# EAGLE design Schematic SF FM v1.26 (EAGLE 9.6.2)

## Sheet 1 of 3: MULTI-SPEC CAMERA MISSION
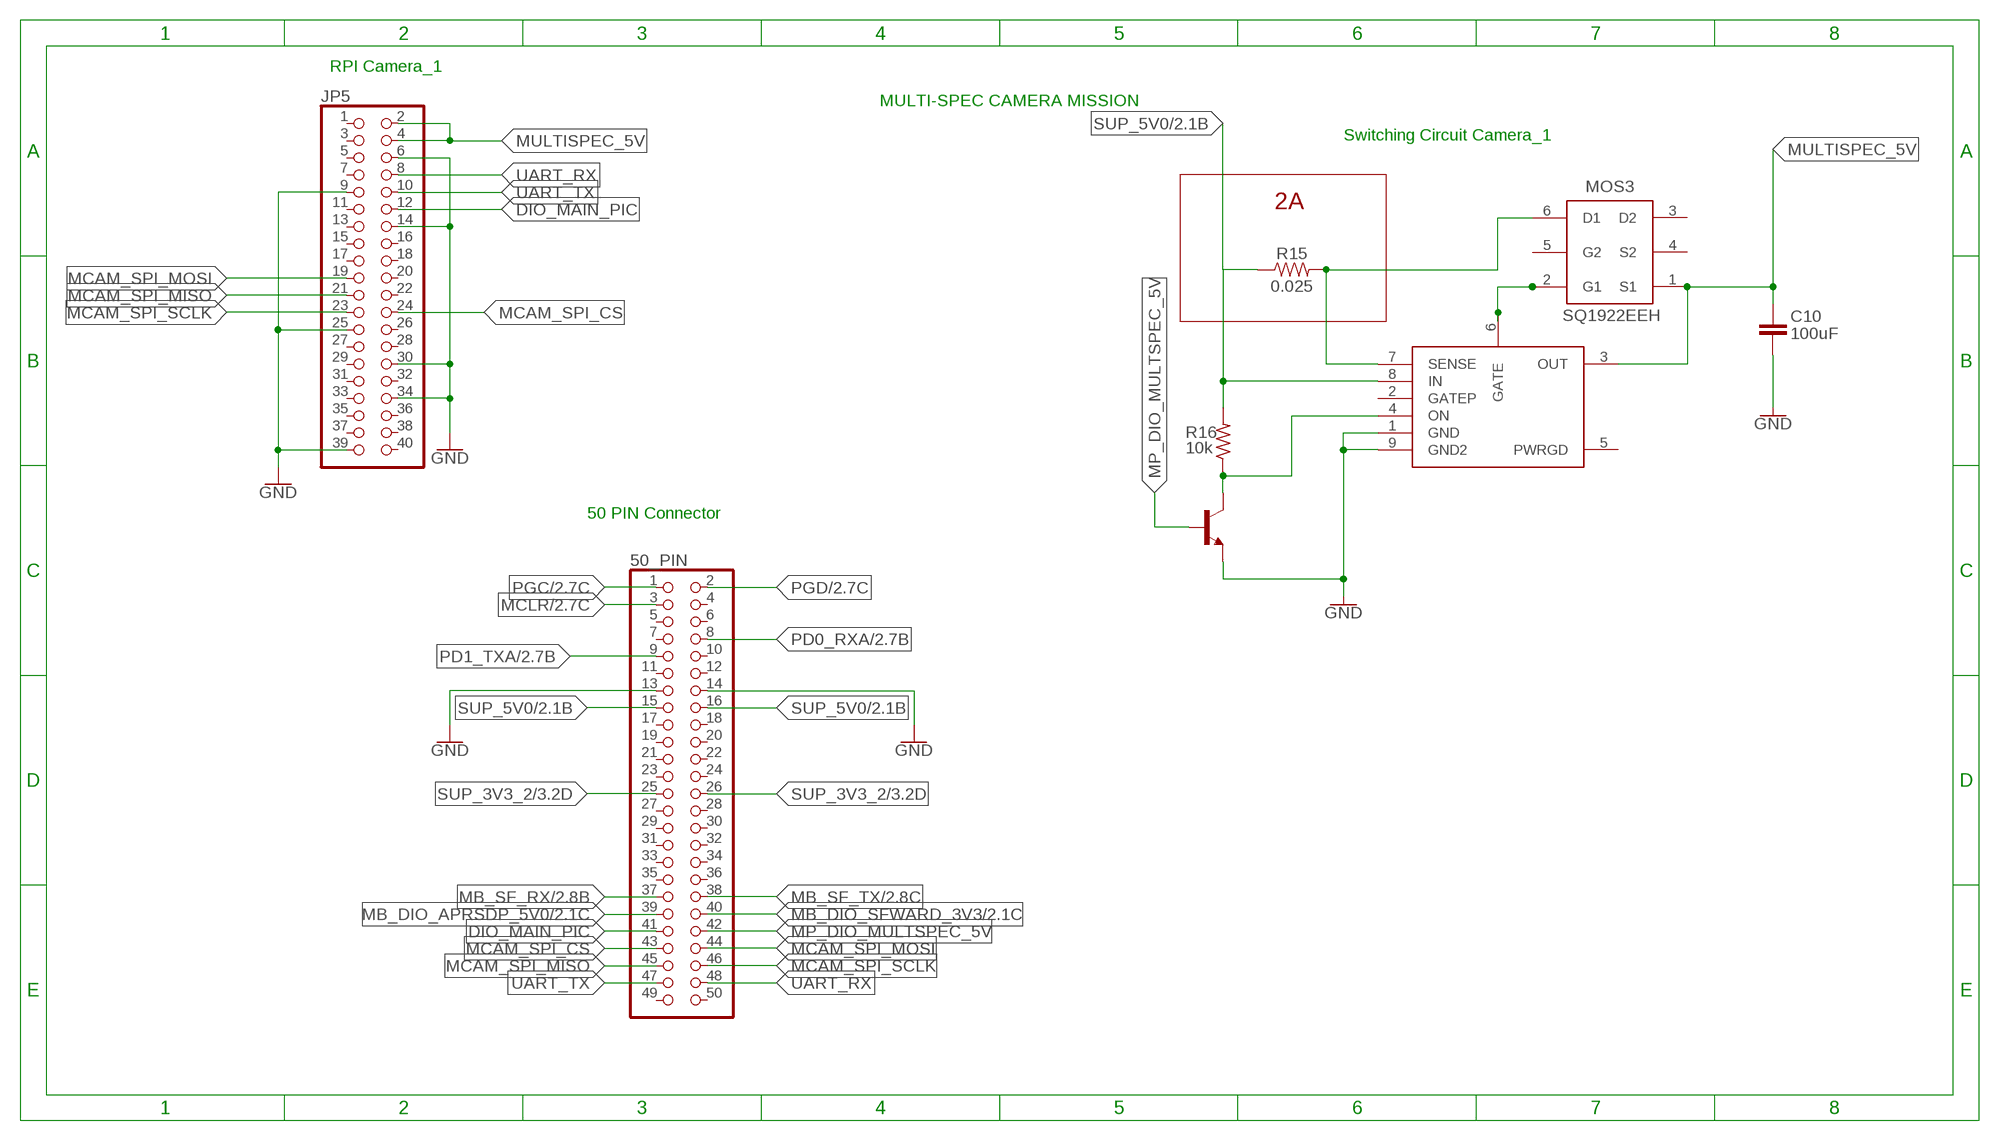
[diagram p0: schematic, sheet 1]

### Parts
50_PIN  PINHD-2X25_2.00  [2X25M]
C10  100uF  C0805(2012)  [C0805]
JP5  PINHD-2X20  [2X20]
MOS3  SQ1922EEH  [SOT65P210X110-6N]
Q4  DTC144EKA  [SOT346-R]
R15  0.025  R0805(2012)  [R0805]
R16  10k  R-US_R0603  [R0603]
U$2  BIRDS5_LTC4361  [BIRDS5_LTC4361]

### Nets
DIO_MAIN_PIC: 50_PIN.41 JP5.12
GATE1: MOS3.2(G1) U$2.6(GATE)
GND: 50_PIN.13 50_PIN.14 C10.2 JP5.6 JP5.9 JP5.14 JP5.25 JP5.30 JP5.34 JP5.39 Q4.1(E) U$2.1(GND) U$2.9(GND2) ; also sheet 2,3
MB_DIO_APRSDP_5V0: 50_PIN.39 ; also sheet 2
MB_DIO_SFWARD_3V3: 50_PIN.40 ; also sheet 2,3
MB_SF_RX: 50_PIN.37 ; also sheet 2,3
MB_SF_TX: 50_PIN.38 ; also sheet 2,3
MCAM_SPI_CS: 50_PIN.43 JP5.24
MCAM_SPI_MISO: 50_PIN.45 JP5.21
MCAM_SPI_MOSI: 50_PIN.44 JP5.19
MCAM_SPI_SCLK: 50_PIN.46 JP5.23
MCLR: 50_PIN.3 ; also sheet 2,3
MP_DIO_MULTSPEC_5V: 50_PIN.42 Q4.2(B)
MULTISPEC_5V: C10.1 JP5.2 JP5.4 MOS3.1(S1) U$2.3(OUT)
ON1: Q4.3(C) R16.1 U$2.4(ON)
PD0_RXA: 50_PIN.8 ; also sheet 2
PD1_TXA: 50_PIN.9 ; also sheet 2
PGC: 50_PIN.1 ; also sheet 2,3
PGD: 50_PIN.2 ; also sheet 2,3
SENSE1: MOS3.6(D1) R15.2 U$2.7(SENSE)
SUP_3V3_2: 50_PIN.25 50_PIN.26 ; also sheet 3
SUP_5V0: 50_PIN.15 50_PIN.16 R15.1 R16.2 U$2.8(IN) ; also sheet 2
UART_RX: 50_PIN.48 JP5.8
UART_TX: 50_PIN.47 JP5.10
Unconnected: 50_PIN.4 50_PIN.5 50_PIN.6 50_PIN.7 50_PIN.10 50_PIN.11 50_PIN.12 50_PIN.17 50_PIN.18 50_PIN.19 50_PIN.20 50_PIN.21 50_PIN.22 50_PIN.23 50_PIN.24 50_PIN.27 50_PIN.28 50_PIN.29 50_PIN.30 50_PIN.31 50_PIN.32 50_PIN.33 50_PIN.34 50_PIN.35 50_PIN.36 50_PIN.49 50_PIN.50 JP5.1 JP5.3 JP5.5 JP5.7 JP5.11 JP5.13 JP5.15 JP5.16 JP5.17 JP5.18 JP5.20 JP5.22 JP5.26 JP5.27 JP5.28 JP5.29 JP5.31 JP5.32 JP5.33 JP5.35 JP5.36 JP5.37 JP5.38 JP5.40 MOS3.3(D2) MOS3.4(S2) MOS3.5(G2) U$2.2(GATEP) U$2.5(PWRGD)

### Notes on the sheet
- RPI Camera_1
- MULTI-SPEC CAMERA MISSION
- Switching Circuit Camera_1
- 2A
- 50 PIN Connector

## Sheet 2 of 3: APRS/DP MISSION
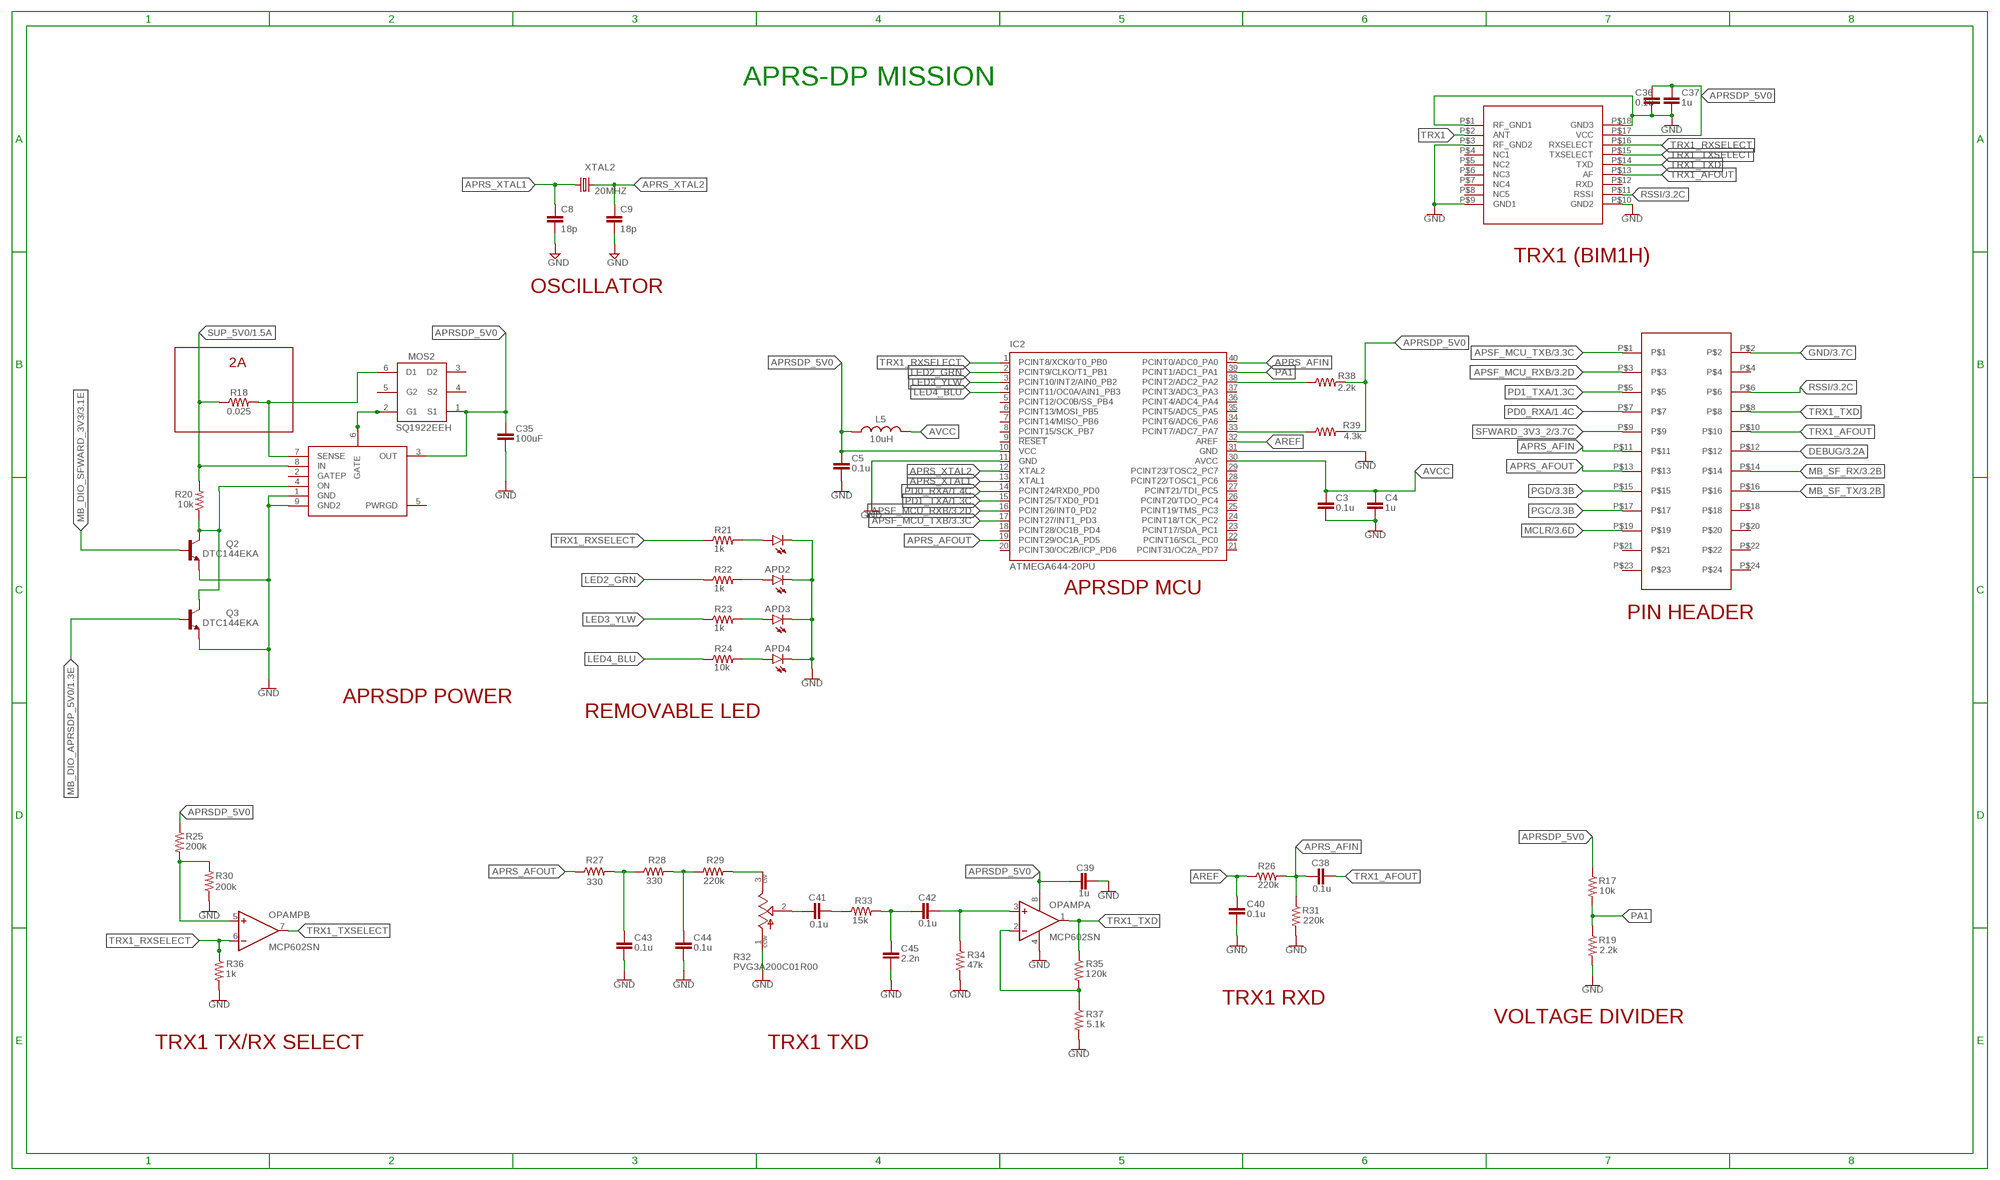
[diagram p1: schematic, sheet 2]

### Parts
APD1  LEDSML0603  [SML0603]
APD2  LEDSML0603  [SML0603]
APD3  LEDSML0603  [SML0603]
APD4  LEDSML0603  [SML0603]
C3  0.1u  CC0603  [C0603]
C4  1u  CC0603  [C0603]
C5  0.1u  CC0603  [C0603]
C8  18p  C  [C0805]
C9  18p  C  [C0805]
C35  100uF  C0805(2012)  [C0805]
C36  0.1u  CC0603  [C0603]
C37  1u  CC0603  [C0603]
C38  0.1u  CC0603  [C0603]
C39  1u  CC0603  [C0603]
C40  0.1u  CC0603  [C0603]
C41  0.1u  CC0603  [C0603]
C42  0.1u  CC0603  [C0603]
C43  0.1u  CC0603  [C0603]
C44  0.1u  CC0603  [C0603]
C45  2.2n  CC0603  [C0603]
IC2  ATMEGA644-20PU  [DIL40]
JP1  RAB_ACCESS  [RAB_ACCESS]
L5  10uH  L-USL2012C  [L2012C]
MOS2  SQ1922EEH  [SOT65P210X110-6N]
OPAMP  MCP602SN  [SO08]
Q2  DTC144EKA  [SOT346-R]
Q3  DTC144EKA  [SOT346-R]
R17  10k  R-US_R0603  [R0603]
R18  0.025  R-US_R0805  [R0805]
R19  2.2k  R-US_R0603  [R0603]
R20  10k  R-US_R0603  [R0603]
R21  1k  R-US_R0603  [R0603]
R22  1k  R-US_R0603  [R0603]
R23  1k  R-US_R0603  [R0603]
R24  10k  R-US_R0603  [R0603]
R25  200k  R-US_R0603  [R0603]
R26  220k  R-US_R0603  [R0603]
R27  330  R-US_R0603  [R0603]
R28  330  R-US_R0603  [R0603]
R29  220k  R-US_R0603  [R0603]
R30  200k  R-US_R0603  [R0603]
R31  220k  R-US_R0603  [R0603]
R32  PVG3A200C01R00  [TRIM_PVG3A200C01R00]
R33  15k  R-US_R0603  [R0603]
R34  47k  R-US_R0603  [R0603]
R35  120k  R-US_R0603  [R0603]
R36  1k  R-US_R0603  [R0603]
R37  5.1k  R-US_R0603  [R0603]
R38  2.2k  R-US_R0603  [R0603]
R39  4.3k  R-US_R0603  [R0603]
TRX1  BIM1H  [BIM1H]
U$1  BIRDS5_LTC4361  [BIRDS5_LTC4361]
XTAL2  20MHZ  CRYSTALSM49  [SM49]

### Nets
APRS_AFIN: C38.1 IC2.40(PCINT0/ADC0_PA0) JP1.P$11 R26.2 R31.1
APRS_AFOUT: IC2.19(PCINT29/OC1A_PD5) JP1.P$13 R27.1
APRS_XTAL1: C8.1 IC2.13(XTAL1) XTAL2.1
APRS_XTAL2: C9.1 IC2.12(XTAL2) XTAL2.2
APRSDP_5V0: C5.2 C35.1 C36.1 C37.1 C39.1 IC2.10(VCC) L5.1 MOS2.1(S1) OPAMP.8(P:V+) R17.1 R25.1 R38.2 R39.2 TRX1.P$17(VCC) U$1.3(OUT)
APSF_MCU_RXB: IC2.16(PCINT26/INT0_PD2) JP1.P$3 ; also sheet 3
APSF_MCU_TXB: IC2.17(PCINT27/INT1_PD3) JP1.P$1 ; also sheet 3
AREF: C40.1 IC2.32(AREF) R26.1
AVCC: C3.1 C4.1 IC2.30(AVCC) L5.2
DEBUG: JP1.P$12 ; also sheet 3
GATE4: MOS2.2(G1) U$1.6(GATE)
GND: APD1.C APD2.C APD3.C APD4.C C3.2 C4.2 C5.1 C8.2 C9.2 C35.2 C36.2 C37.2 C39.2 C40.2 C43.2 C44.2 C45.2 IC2.11(GND) IC2.31(GND) JP1.P$2 OPAMP.4(P:V-) Q2.1(E) Q3.1(E) R19.2 R30.1 R31.2 R32.1(CCW) R34.2 R36.2 R37.2 TRX1.P$1(RF_GND1) TRX1.P$3(RF_GND2) TRX1.P$9(GND1) TRX1.P$10(GND2) TRX1.P$18(GND3) U$1.1(GND) U$1.9(GND2) ; also sheet 1,3
LED2_GRN: IC2.2(PCINT9/CLKO/T1_PB1) R22.1
LED3_YLW: IC2.3(PCINT10/INT2/AIN0_PB2) R23.1
LED4_BLU: IC2.4(PCINT11/OC0A/AIN1_PB3) R24.1
MB_DIO_APRSDP_5V0: Q3.2(B) ; also sheet 1
MB_DIO_SFWARD_3V3: Q2.2(B) ; also sheet 1,3
MB_SF_RX: JP1.P$14 ; also sheet 1,3
MB_SF_TX: JP1.P$16 ; also sheet 1,3
MCLR: JP1.P$19 ; also sheet 1,3
N$10: R29.2 R32.3(CW)
N$12: APD1.A R21.2
N$13: APD2.A R22.2
N$14: APD3.A R23.2
N$15: APD4.A R24.2
N$16: C43.1 R27.2 R28.1
N$17: C44.1 R28.2 R29.1
N$18: C42.1 C45.1 R33.2
N$19: C41.2 R33.1
N$20: OPAMP.2(A:-IN) R35.2 R37.1
N$21: OPAMP.5(B:+IN) R25.2 R30.2
N$22: C41.1 R32.2(WIPER)
N$34: IC2.38(PCINT2/ADC2_PA2) R38.1
N$38: IC2.33(PCINT7/ADC7_PA7) R39.1
ON4: Q2.3(C) Q3.3(C) R20.1 U$1.4(ON)
OPAMP_A+: C42.2 OPAMP.3(A:+IN) R34.1
PA1: IC2.39(PCINT1/ADC1_PA1) R17.2 R19.1
PD0_RXA: IC2.14(PCINT24/RXD0_PD0) JP1.P$7 ; also sheet 1
PD1_TXA: IC2.15(PCINT25/TXD0_PD1) JP1.P$5 ; also sheet 1
PGC: JP1.P$17 ; also sheet 1,3
PGD: JP1.P$15 ; also sheet 1,3
RSSI: JP1.P$6 TRX1.P$11(RSSI) ; also sheet 3
SENSE4: MOS2.6(D1) R18.2 U$1.7(SENSE)
SFWARD_3V3_2: JP1.P$9 ; also sheet 3
SUP_5V0: R18.1 R20.2 U$1.8(IN) ; also sheet 1
TRX1: TRX1.P$2(ANT) ; also sheet 3
TRX1_AFOUT: C38.2 JP1.P$10 TRX1.P$13(AF)
TRX1_RXSELECT: IC2.1(PCINT8/XCK0/T0_PB0) OPAMP.6(B:-IN) R21.1 R36.1 TRX1.P$16(RXSELECT)
TRX1_TXD: JP1.P$8 OPAMP.1(A:OUT) R35.1 TRX1.P$14(TXD)
TRX1_TXSELECT: OPAMP.7(B:OUT) TRX1.P$15(TXSELECT)
Unconnected: IC2.5(PCINT12/OC0B/SS_PB4) IC2.6(PCINT13/MOSI_PB5) IC2.7(PCINT14/MISO_PB6) IC2.8(PCINT15/SCK_PB7) IC2.9(!RESET) IC2.18(PCINT28/OC1B_PD4) IC2.20(PCINT30/OC2B/ICP_PD6) IC2.21(PCINT31/OC2A_PD7) IC2.22(PCINT16/SCL_PC0) IC2.23(PCINT17/SDA_PC1) IC2.24(PCINT18/TCK_PC2) IC2.25(PCINT19/TMS_PC3) IC2.26(PCINT20/TDO_PC4) IC2.27(PCINT21/TDI_PC5) IC2.28(PCINT22/TOSC1_PC6) IC2.29(PCINT23/TOSC2_PC7) IC2.34(PCINT6/ADC6_PA6) IC2.35(PCINT5/ADC5_PA5) IC2.36(PCINT4/ADC4_PA4) IC2.37(PCINT3/ADC3_PA3) JP1.P$4 JP1.P$18 JP1.P$20 JP1.P$21 JP1.P$22 JP1.P$23 JP1.P$24 MOS2.3(D2) MOS2.4(S2) MOS2.5(G2) TRX1.P$4(NC1) TRX1.P$5(NC2) TRX1.P$6(NC3) TRX1.P$7(NC4) TRX1.P$8(NC5) TRX1.P$12(RXD) U$1.2(GATEP) U$1.5(PWRGD)

### Notes on the sheet
- APRS-DP MISSION
- TRX1 (BIM1H)
- OSCILLATOR
- 2A
- APRSDP MCU
- PIN HEADER
- APRSDP POWER
- REMOVABLE LED
- TRX1 RXD
- VOLTAGE DIVIDER
- TRX1 TX/RX SELECT | TRX1 TXD

## Sheet 3 of 3: SF-WARD MISSION
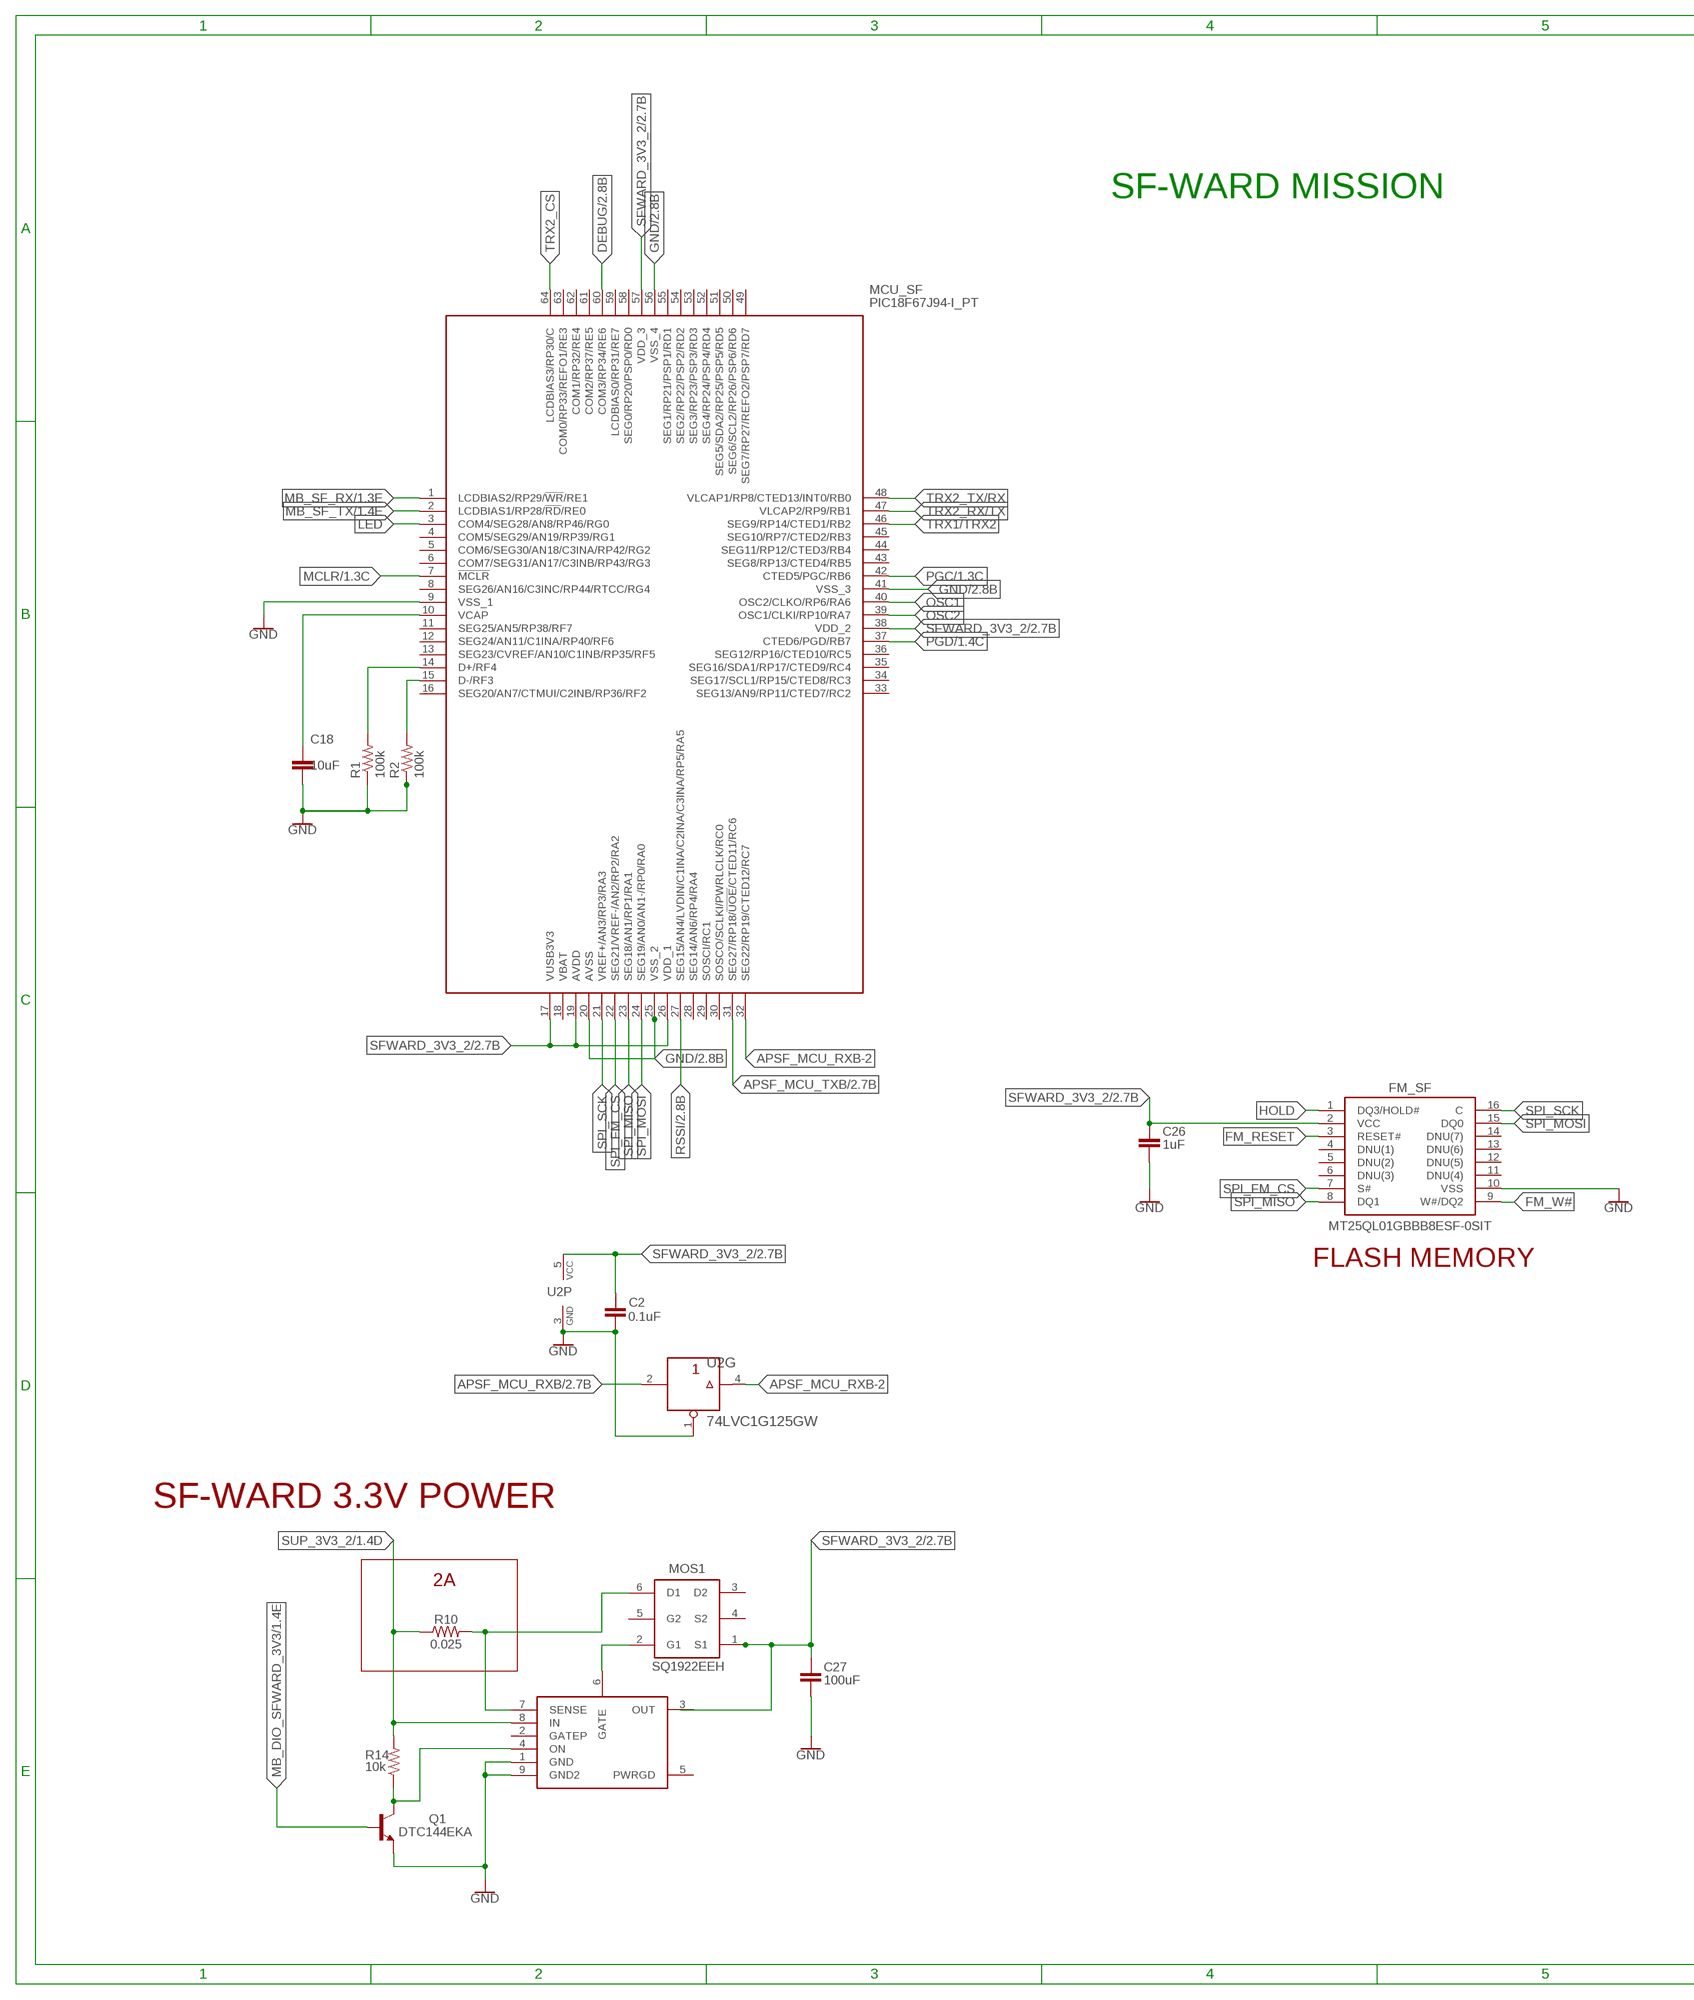
[diagram p2: schematic, sheet 3, part 1 of 2]
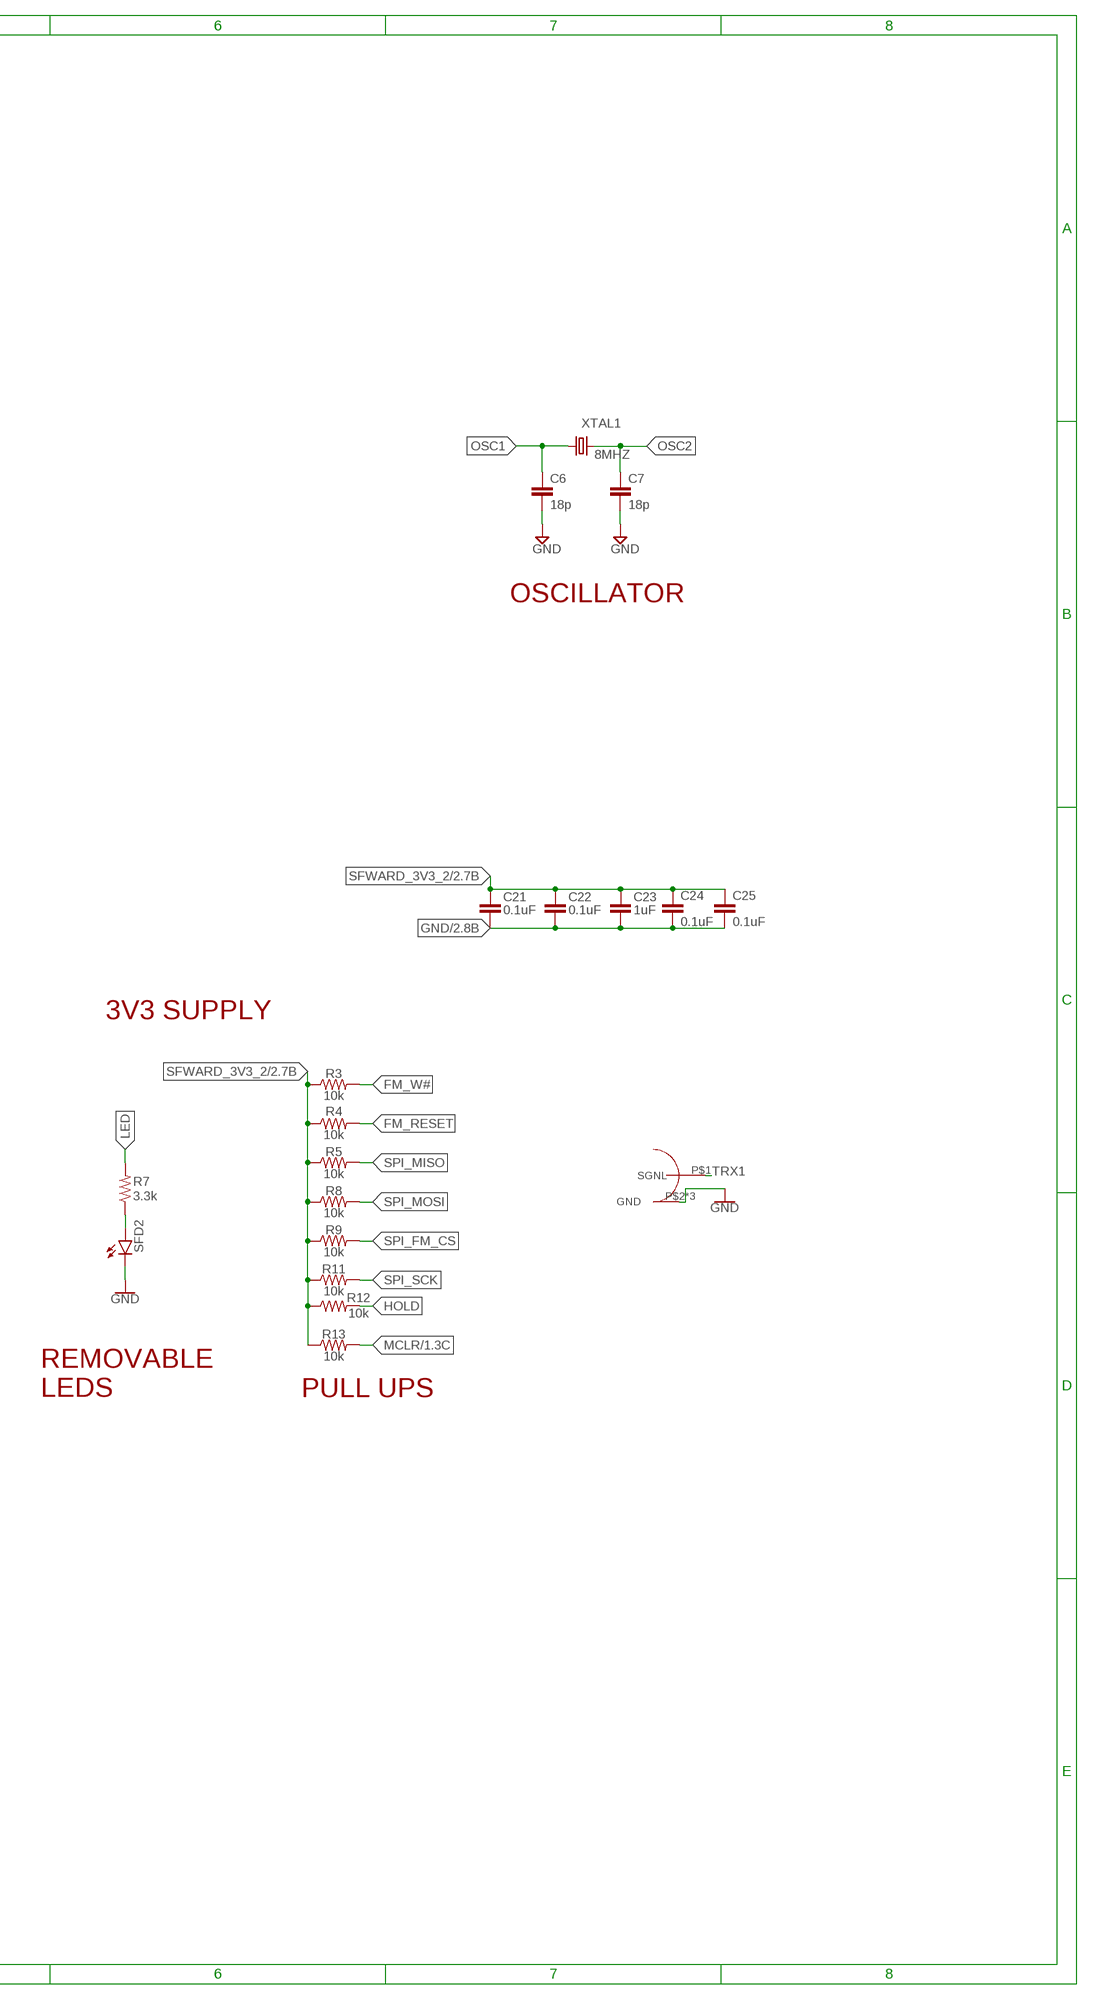
[diagram p3: schematic, sheet 3, part 2 of 2]

### Parts
C2  0.1uF  CC0603  [C0603]
C6  18p  C  [C0805]
C7  18p  C  [C0805]
C18  10uF  C-EUC0603  [C0603]
C21  0.1uF  C-EUC0603  [C0603]
C22  0.1uF  C-EUC0603  [C0603]
C23  1uF  C-EUC0603  [C0603]
C24  0.1uF  C-EUC0603  [C0603]
C25  0.1uF  C-EUC0603  [C0603]
C26  1uF  C-EUC0603  [C0603]
C27  100uF  C0805(2012)  [C0805]
FM_SF  MT25QL01GBBB8ESF-0SIT  [SOIC127P1032X265-16N]
MCU_SF  PIC18F67J94-I_PT  [QFP50P1200X1200X120-64N]
MMCX_908_222101T  MMCX_908_222101T  [MMCX_908_222101T]
MOS1  SQ1922EEH  [SOT65P210X110-6N]
Q1  DTC144EKA  [SOT346-R]
R1  100k  R-US_R0603  [R0603]
R2  100k  R-US_R0603  [R0603]
R3  10k  R-US_R0603  [R0603]
R4  10k  R-US_R0603  [R0603]
R5  10k  R-US_R0603  [R0603]
R7  3.3k  R-US_R0603  [R0603]
R8  10k  R-US_R0603  [R0603]
R9  10k  R-US_R0603  [R0603]
R10  0.025  R0805(2012)  [R0805]
R11  10k  R-US_R0603  [R0603]
R12  10k  R-US_R0603  [R0603]
R13  10k  R-US_R0603  [R0603]
R14  10k  R-US_R0603  [R0603]
SFD2  LEDCHIPLED_0603  [CHIPLED_0603]
U2  74LVC1G125GW  [SOT353-1]
U$3  BIRDS5_LTC4361  [BIRDS5_LTC4361]
XTAL1  8MHZ  CRYSTALSM49  [SM49]

### Nets
APSF_MCU_RXB: U2.2(G:A) ; also sheet 2
APSF_MCU_RXB-2: MCU_SF.32(SEG22/RP19/CTED12/RC7) U2.4(G:Y)
APSF_MCU_TXB: MCU_SF.31(SEG27/RP18/!UOE!/CTED11/RC6) ; also sheet 2
DEBUG: MCU_SF.60(COM3/RP34/RE6) ; also sheet 2
FM_RESET: FM_SF.3(RESET#) R4.2
FM_W#: FM_SF.9(W#/DQ2) R3.2
GATE3: MOS1.2(G1) U$3.6(GATE)
GND: C2.1 C6.2 C7.2 C18.2 C21.2 C22.2 C23.2 C24.2 C25.2 C26.2 C27.2 FM_SF.10(VSS) MCU_SF.9(VSS_1) MCU_SF.20(AVSS) MCU_SF.25(VSS_2) MCU_SF.41(VSS_3) MCU_SF.56(VSS_4) MMCX_908_222101T.P$2(GND) MMCX_908_222101T.P$3(GND) MMCX_908_222101T.P$4(GND) Q1.1(E) R1.1 R2.1 SFD2.C U2.1(G:OEN) U2.3(P:GND) U$3.1(GND) U$3.9(GND2) ; also sheet 1,2
HOLD: FM_SF.1(DQ3/HOLD#) R12.2
LED: MCU_SF.3(COM4/SEG28/AN8/RP46/RG0) R7.2
MB_DIO_SFWARD_3V3: Q1.2(B) ; also sheet 1,2
MB_SF_RX: MCU_SF.1(LCDBIAS2/RP29/!WR!/RE1) ; also sheet 1,2
MB_SF_TX: MCU_SF.2(LCDBIAS1/RP28/!RD!/RE0) ; also sheet 1,2
MCLR: MCU_SF.7(!MCLR) R13.2 ; also sheet 1,2
N$2: C18.1 MCU_SF.10(VCAP)
N$7: MCU_SF.14(D+/RF4) R1.2
N$8: MCU_SF.15(D-/RF3) R2.2
N$11: R7.1 SFD2.A
ON3: Q1.3(C) R14.1 U$3.4(ON)
OSC1: C6.1 MCU_SF.40(OSC2/CLKO/RP6/RA6) XTAL1.1
OSC2: C7.1 MCU_SF.39(OSC1/CLKI/RP10/RA7) XTAL1.2
PGC: MCU_SF.42(CTED5/PGC/RB6) ; also sheet 1,2
PGD: MCU_SF.37(CTED6/PGD/RB7) ; also sheet 1,2
RSSI: MCU_SF.27(SEG15/AN4/LVDIN/C1INA/C2INA/C3INA/RP5/RA5) ; also sheet 2
SENSE3: MOS1.6(D1) R10.2 U$3.7(SENSE)
SFWARD_3V3_2: C2.2 C21.1 C22.1 C23.1 C24.1 C25.1 C26.1 C27.1 FM_SF.2(VCC) MCU_SF.17(VUSB3V3) MCU_SF.19(AVDD) MCU_SF.26(VDD_1) MCU_SF.38(VDD_2) MCU_SF.57(VDD_3) MOS1.1(S1) R3.1 R4.1 R5.1 R8.1 R9.1 R11.1 R12.1 R13.1 U2.5(P:VCC) U$3.3(OUT) ; also sheet 2
SPI_FM_CS: FM_SF.7(S#) MCU_SF.22(SEG21/VREF-/AN2/RP2/RA2) R9.2
SPI_MISO: FM_SF.8(DQ1) MCU_SF.23(SEG18/AN1/RP1/RA1) R5.2
SPI_MOSI: FM_SF.15(DQ0) MCU_SF.24(SEG19/AN0/AN1-/RP0/RA0) R8.2
SPI_SCK: FM_SF.16(C) MCU_SF.21(VREF+/AN3/RP3/RA3) R11.2
SUP_3V3_2: R10.1 R14.2 U$3.8(IN) ; also sheet 1
TRX1: MMCX_908_222101T.P$1(SGNL) ; also sheet 2
TRX1/TRX2: MCU_SF.46(SEG9/RP14/CTED1/RB2)
TRX2_CS: MCU_SF.64(LCDBIAS3/RP30/C)
TRX2_RX/TX: MCU_SF.47(VLCAP2/RP9/RB1)
TRX2_TX/RX: MCU_SF.48(VLCAP1/RP8/CTED13/INT0/RB0)
Unconnected: FM_SF.4(DNU(1)) FM_SF.5(DNU(2)) FM_SF.6(DNU(3)) FM_SF.11(DNU(4)) FM_SF.12(DNU(5)) FM_SF.13(DNU(6)) FM_SF.14(DNU(7)) MCU_SF.4(COM5/SEG29/AN19/RP39/RG1) MCU_SF.5(COM6/SEG30/AN18/C3INA/RP42/RG2) MCU_SF.6(COM7/SEG31/AN17/C3INB/RP43/RG3) MCU_SF.8(SEG26/AN16/C3INC/RP44/RTCC/RG4) MCU_SF.11(SEG25/AN5/RP38/RF7) MCU_SF.12(SEG24/AN11/C1INA/RP40/RF6) MCU_SF.13(SEG23/CVREF/AN10/C1INB/RP35/RF5) MCU_SF.16(SEG20/AN7/CTMUI/C2INB/RP36/RF2) MCU_SF.18(VBAT) MCU_SF.28(SEG14/AN6/RP4/RA4) MCU_SF.29(SOSCI/RC1) MCU_SF.30(SOSCO/SCLKI/PWRLCLK/RC0) MCU_SF.33(SEG13/AN9/RP11/CTED7/RC2) MCU_SF.34(SEG17/SCL1/RP15/CTED8/RC3) MCU_SF.35(SEG16/SDA1/RP17/CTED9/RC4) MCU_SF.36(SEG12/RP16/CTED10/RC5) MCU_SF.43(SEG8/RP13/CTED4/RB5) MCU_SF.44(SEG11/RP12/CTED3/RB4) MCU_SF.45(SEG10/RP7/CTED2/RB3) MCU_SF.49(SEG7/RP27/REFO2/PSP7/RD7) MCU_SF.50(SEG6/SCL2/RP26/PSP6/RD6) MCU_SF.51(SEG5/SDA2/RP25/PSP5/RD5) MCU_SF.52(SEG4/RP24/PSP4/RD4) MCU_SF.53(SEG3/RP23/PSP3/RD3) MCU_SF.54(SEG2/RP22/PSP2/RD2) MCU_SF.55(SEG1/RP21/PSP1/RD1) MCU_SF.58(SEG0/RP20/PSP0/RD0) MCU_SF.59(LCDBIAS0/RP31/RE7) MCU_SF.61(COM2/RP37/RE5) MCU_SF.62(COM1/RP32/RE4) MCU_SF.63(COM0/RP33/REFO1/RE3) MOS1.3(D2) MOS1.4(S2) MOS1.5(G2) U$3.2(GATEP) U$3.5(PWRGD)

### Notes on the sheet
- SF-WARD MISSION
- OSCILLATOR
- 3V3 SUPPLY
- FLASH MEMORY
- REMOVABLE
  LEDS
- PULL UPS
- SF-WARD 3.3V POWER
- 2A

## Library data of the parts
50_PIN = pinhead-1:PINHD-2X25: PIN HEADER
APD1-APD4 SFD2 = led:LED: LED OSRAM: - CHIPLED LG R971, LG N971, LY N971, LG Q971, LY Q971, LO R971, LY R971 LH N974, LH R974 LS Q976, LO Q976, LY Q976 LO Q996 - Hyper CHIPLED LW Q18S LB Q993, LB Q99A, LB R99A - SideLED LS A670, LO A670, LY A670, LG A670, LP A670 LB A673, LV A673, LT A673, LW A673 LH A674 LY A675 LS A676, LA A676, LO A676, LY A676, LW A676 LS A679, LY A679, LG A679 - Hyper Micro SIDELED® LS Y876, LA Y876, LO Y876, LY Y876 LT Y87S - SmartLED LW L88C, LW L88S LB L89C, LB L89S, LG L890 LS L89K, LO L89K, LY L89K LS L896, LA L896, LO L896, LY L896 - TOPLED LS T670, LO T670, LY T670, LG T670, LP T670 LSG T670, LSP T670, LSY T670, LOP T670, LYG T670 LG T671, LOG T671, LSG T671 LB T673, LV T673, LT T673, LW T673 LH T674 LS T676, LA T676, LO T676, LY T676, LB T676, LH T676, LSB T676, LW T676 LB T67C, LV T67C, LT T67C, LS T67K, LO T67K, LY T67K, LW E67C LS E67B, LA E67B, LO E67B, LY E67B, LB E67C, LV E67C, LT E67C LW T67C LS T679, LY T679, LG T679 LS T770, LO T770, LY T770, LG T770, LP T770 LB T773, LV T773, LT T773, LW T773 LH T774 LS E675, LA E675, LY E675, LS T675 LS T776, LA T776, LO T776, LY T776, LB T776 LHGB T686 LT T68C, LB T68C - Hyper Mini TOPLED® LB M676 - Mini TOPLED Santana® LG M470 LS M47K, LO M47K, LY M47K Source: http://www.osram.convergy.de LUXEON: - LUMILED® LXK2-PW12-R00, LXK2-PW12-S00, LXK2-PW14-U00, LXK2-PW14-V00 LXK2-PM12-R00, LXK2-PM12-S00, LXK2-PM14-U00 LXK2-PE12-Q00, LXK2-PE12-R00, LXK2-PE12-S00, LXK2-PE14-T00, LXK2-PE14-U00 LXK2-PB12-K00, LXK2-PB12-L00, LXK2-PB12-M00, LXK2-PB14-N00, LXK2-PB14-P00, LXK2-PB14-Q00 LXK2-PR12-L00, LXK2-PR12-M00, LXK2-PR14-Q00, LXK2-PR14-R00 LXK2-PD12-Q00, LXK2-PD12-R00, LXK2-PD12-S00 LXK2-PH12-R00, LXK2-PH12-S00 LXK2-PL12-P00, LXK2-PL12-Q00, LXK2-PL12-R00 Source: www.luxeon.com KINGBRIGHT: KA-3528ASYC Source: www.kingbright.com
C2-C9 C36-C45 = eagle-ltspice:C: CAPACITOR, European symbol; SPICEMODEL: NONE; SPICEPREFIX: C
C10 C27 C35 = BIRDS3_CAM_MSN:C0805(2012)
C18 C21-C26 = rcl:C-EU: CAPACITOR, European symbol; SPICEPREFIX: C
FM_SF = BIRDS3_CAM_MSN:MT25QL01GBBB8ESF-0SIT: IC FLASH 1GBIT 108MHZ 16SOIC Source: Datasheet <https://www.micron.com/~/media/documents/products/data-sheet/nor-flash/serial-nor/mt25q/die-rev-b/mt25q_qlkt_l_01g_bbb_0.pdf>; DESCRIPTION: IC FLASH 1GBIT 108MHZ 16SOIC; HEIGHT: 2.65mm; MANUFACTURER_NAME: Micron; MANUFACTURER_PART_NUMBER: MT25QL01GBBB8ESF-0SIT; SUPPLIER_NAME: RS
IC2 = atmel:ATMEGA644-*PU: 8-bit Microcontroller with 64K Bytes In-System Programmable Flash Auto generated by make-symbol-device-package-bsdl.ulp Rev. 34 Source: http://www.atmel.com/dyn/resources/prod_documents/doc2593.pdf; MPN: ATMEGA644-20PU; OC_FARNELL: 1288340; OC_NEWARK: 23M5060
JP1 = BIRDS_4_general_components_library:RAB_ACCESS
JP5 = pinhead:PINHD-2X20: PIN HEADER
L5 = rcl:L-US: INDUCTOR, American symbol; SPICEPREFIX: L
MCU_SF = PIC18F67J94-I_PT:PIC18F67J94-I_PT: MCU 8-Bit 128K Flash LCD USB XLP TQFP64 Microchip PIC18F67J94-I/PT, 8bit PIC Microcontroller, 64MHz, 128 kB Flash, 64-Pin TQFP Source: Datasheet <http://uk.rs-online.com/web/p/products/8233908>; ALLIED_NUMBER: 70470236; ALLIED_PRICE-STOCK: https://www.alliedelec.com/microchip-technology-inc-pic18f67j94-i-pt/70470236/; DESCRIPTION: MCU 8-Bit 128K Flash LCD USB XLP TQFP64 Microchip PIC18F67J94-I/PT, 8bit PIC Microcontroller, 64MHz, 128 kB Flash, 64-Pin TQFP; HEIGHT: 1.2mm; MANUFACTURER_NAME: Microchip; MANUFACTURER_PART_NUMBER: PIC18F67J94-I/PT; MOUSER_PART_NUMBER: 579-PIC18F67J94-I/PT; MOUSER_PRICE-STOCK: https://www.mouser.com/Search/Refine.aspx?Keyword=579-PIC18F67J94-I%2FPT; RS_PART_NUMBER: 1652172; RS_PRICE-STOCK: http://uk.rs-online.com/web/p/products/1652172
MMCX_908_222101T = BIRDS_4_general_components_library:MMCX_908_222101T
MOS1-MOS3 = BIRDS3_CAM_MSN:SQ1922EEH
OPAMP = linear:MCP602: Single Op Amp 2.7V to 6.0V Single Supply CMOS Source: http://ww1.microchip.com/downloads/en/DeviceDoc/21314g.pdf
Q1-Q4 = BIRDS3_CAM_MSN:DTC144EKA
R1-R5 R7-R9 R11-R14 R16-R31 R33-R39 = rcl:R-US_: RESISTOR, American symbol; SPICEPREFIX: R
R10 R15 = BIRDS3_CAM_MSN:R0805(2012)
R32 = PVG3A200C01R00:PVG3A200C01R00: Res Cermet Trimmer 20 Ohm 20% 1/4W 1(Elec)/1(Mech)Turn 2.2mm (3.6 X 3.6 X 2mm) J-Hook SMD T/R; DESCRIPTION: Trimmer 20 Ohm 0.25w Smd; DIGI-KEY_PART_NUMBER: 490-2647-1-ND; DIGI-KEY_PURCHASE_URL: https://www.digikey.jp/product-detail/en/bourns-inc/PVG3A200C01R00/490-2647-1-ND/666223?utm_source=snapeda&utm_medium=aggregator&utm_campaign=symbol; MF: Bourns; MP: PVG3A200C01R00; PACKAGE: TO-221 Bourns
TRX1 = BIRDS_4_general_components_library:BIM1H
U2 = Buffers:74LVC1G125: Bus buffer/line driver; 3-state The 74LVC1G125 provides one non-inverting buffer/line driver with 3-state output. The 3-state output is controlled by the output enable input (OE). A HIGH-level at pin OE causes the output to assume a high-impedance OFF-state. The input can be driven from either 3.3 V or 5 V devices. This feature allows the use of this device in a mixed 3.3 V and 5 V environment. This device is fully specified for partial power-down applications using IOFF. The IOFF circuitry disables the output, preventing the damaging backflow current through the device when it is powered down. AAL Eindhoven MK
U$1-U$3 = BIRDS5_LTC4361:BIRDS5_LTC4361
XTAL1 XTAL2 = crystal:CRYSTAL: CRYSTAL; OC_FARNELL: unknown; OC_NEWARK: unknown

## Board
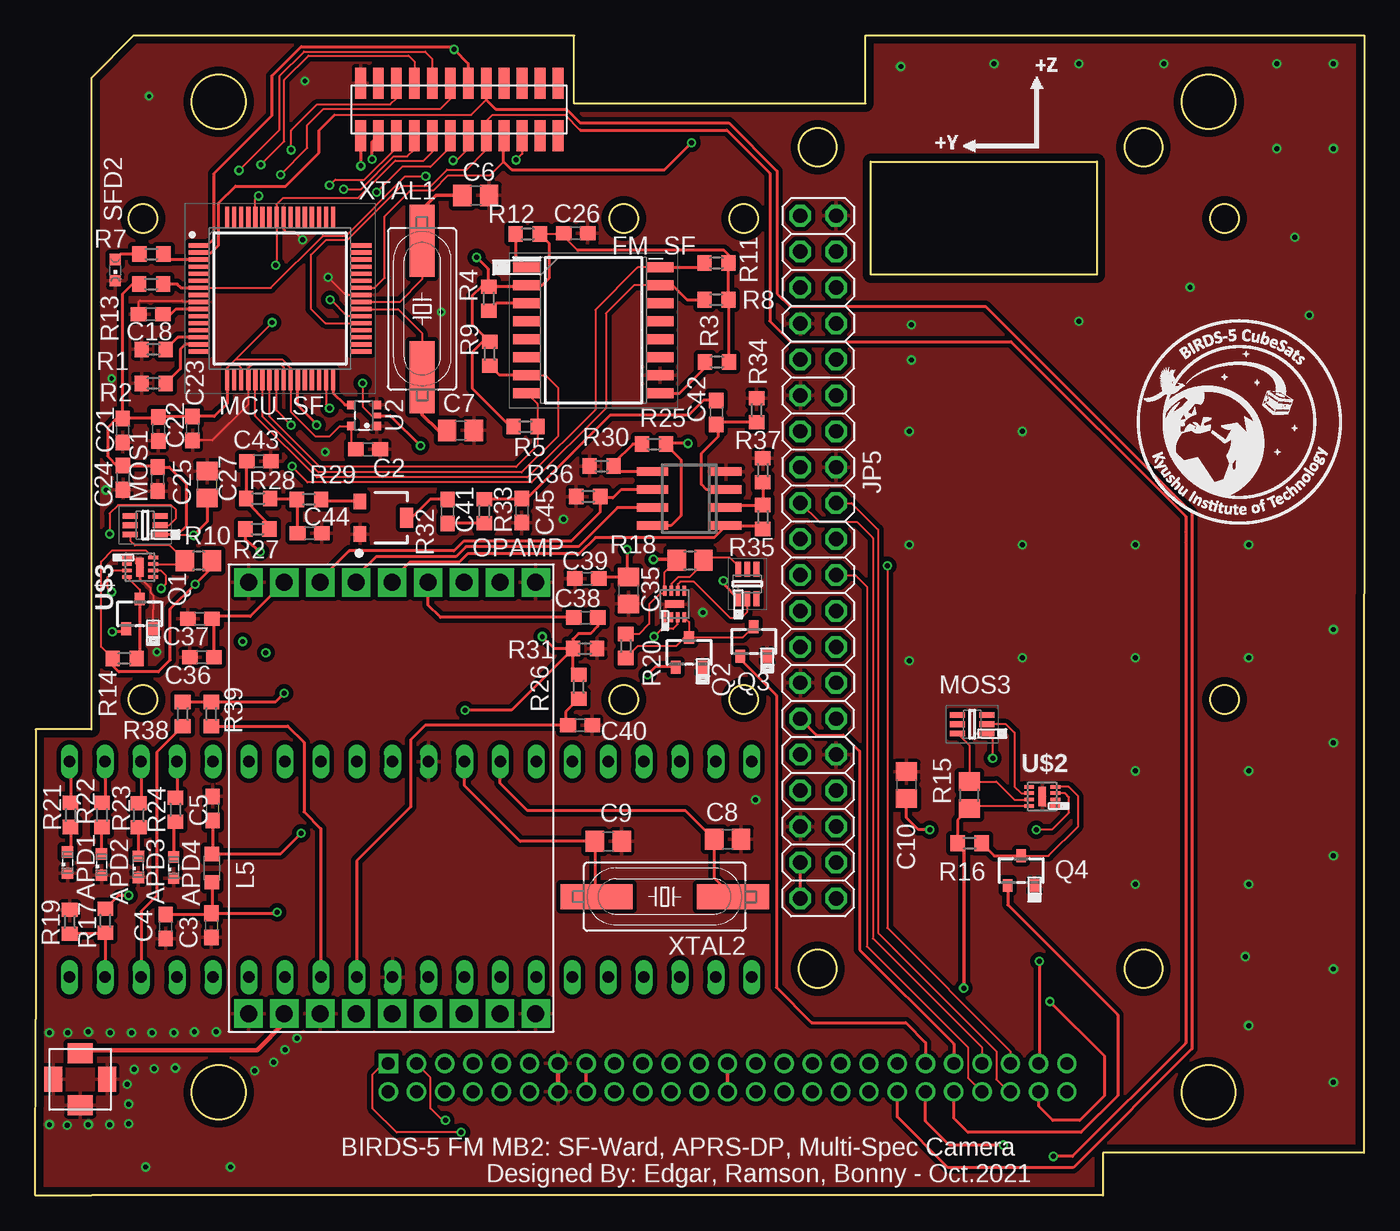
[diagram p4: board, top side]
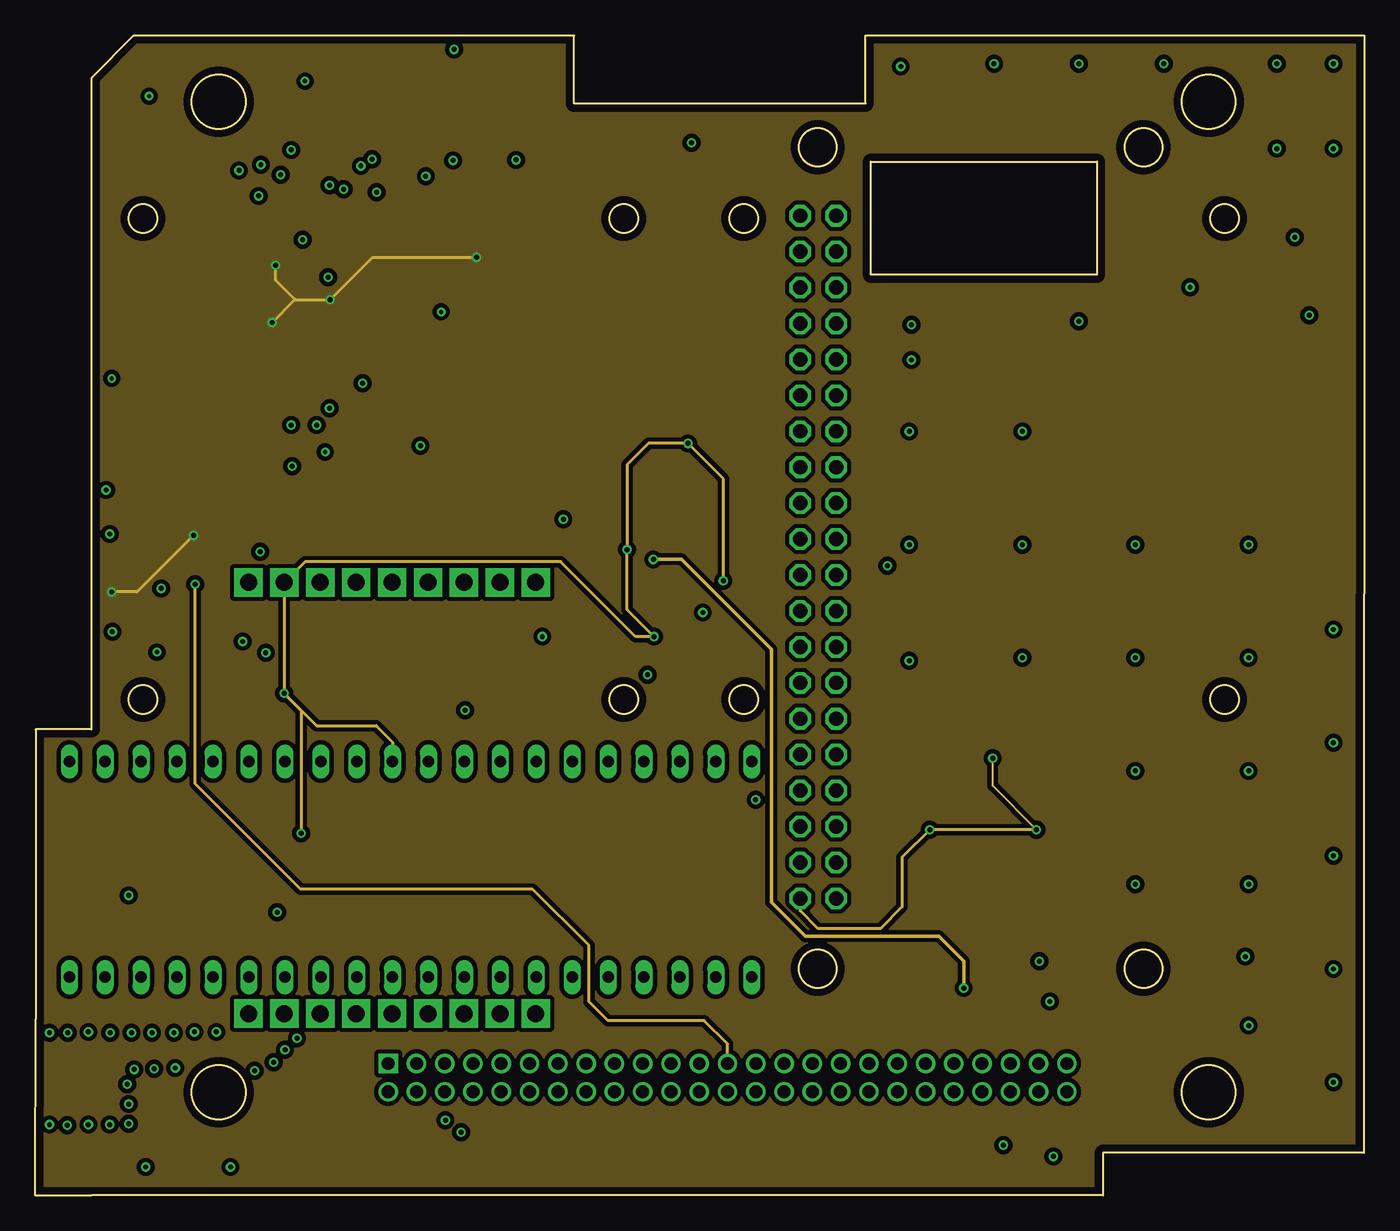
[diagram p5: board, inner layer Route2]
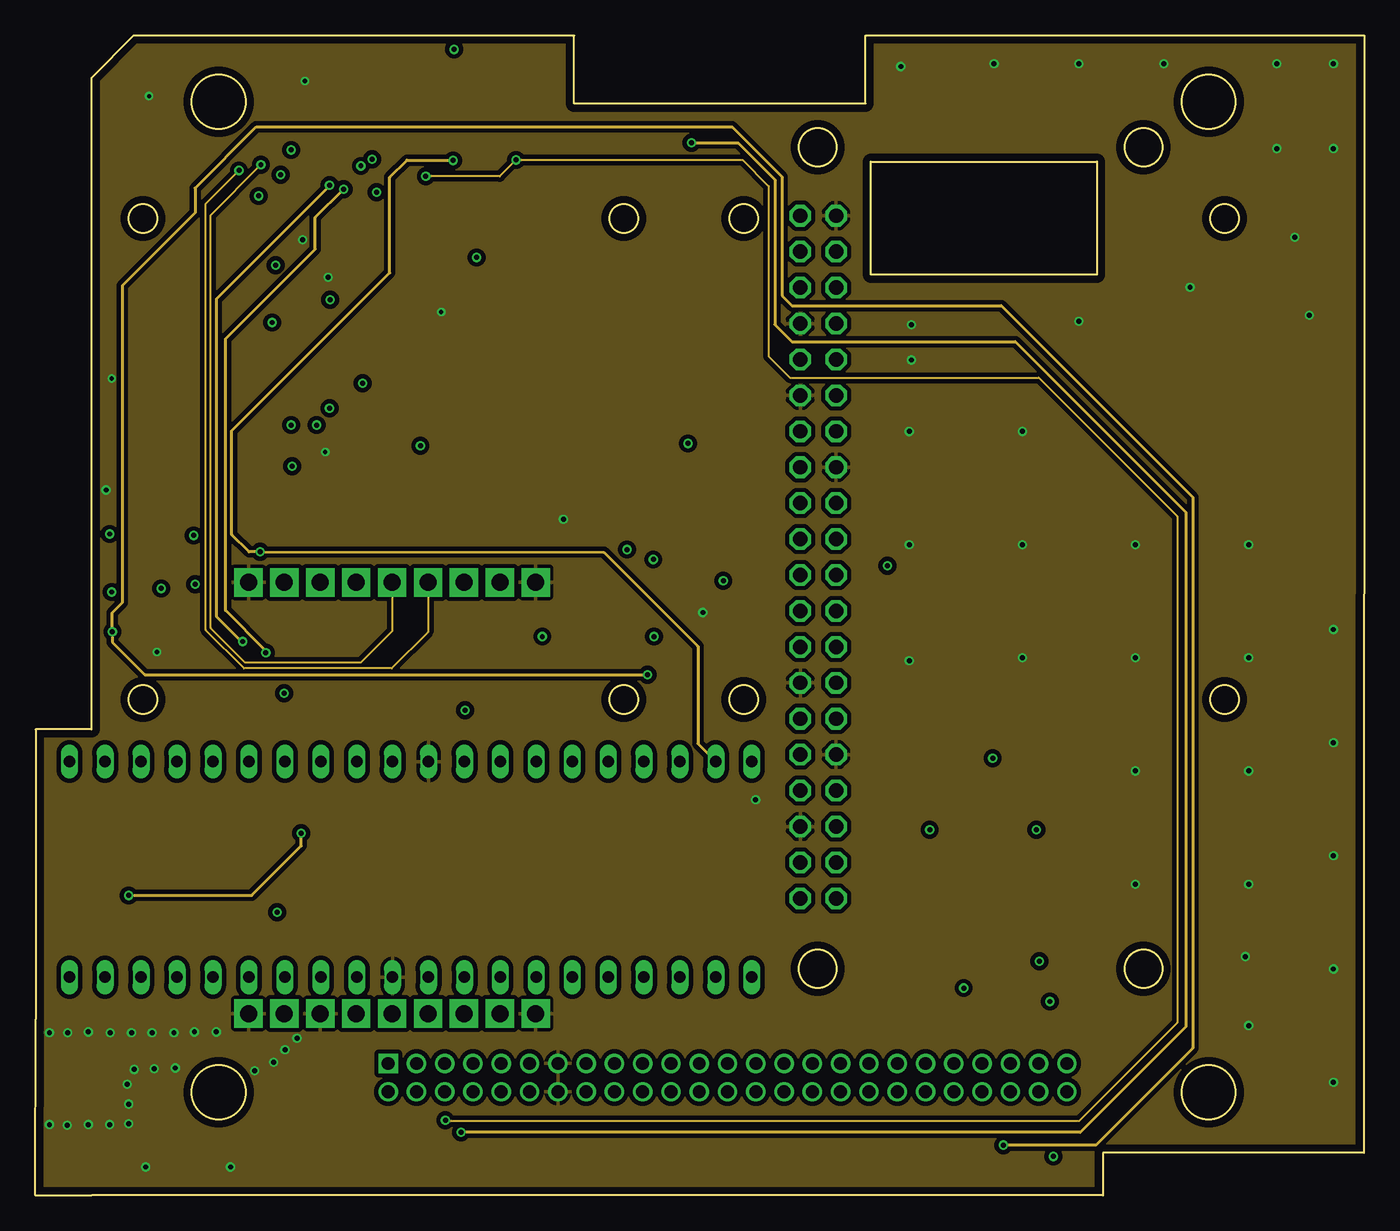
[diagram p6: board, inner layer Route15]
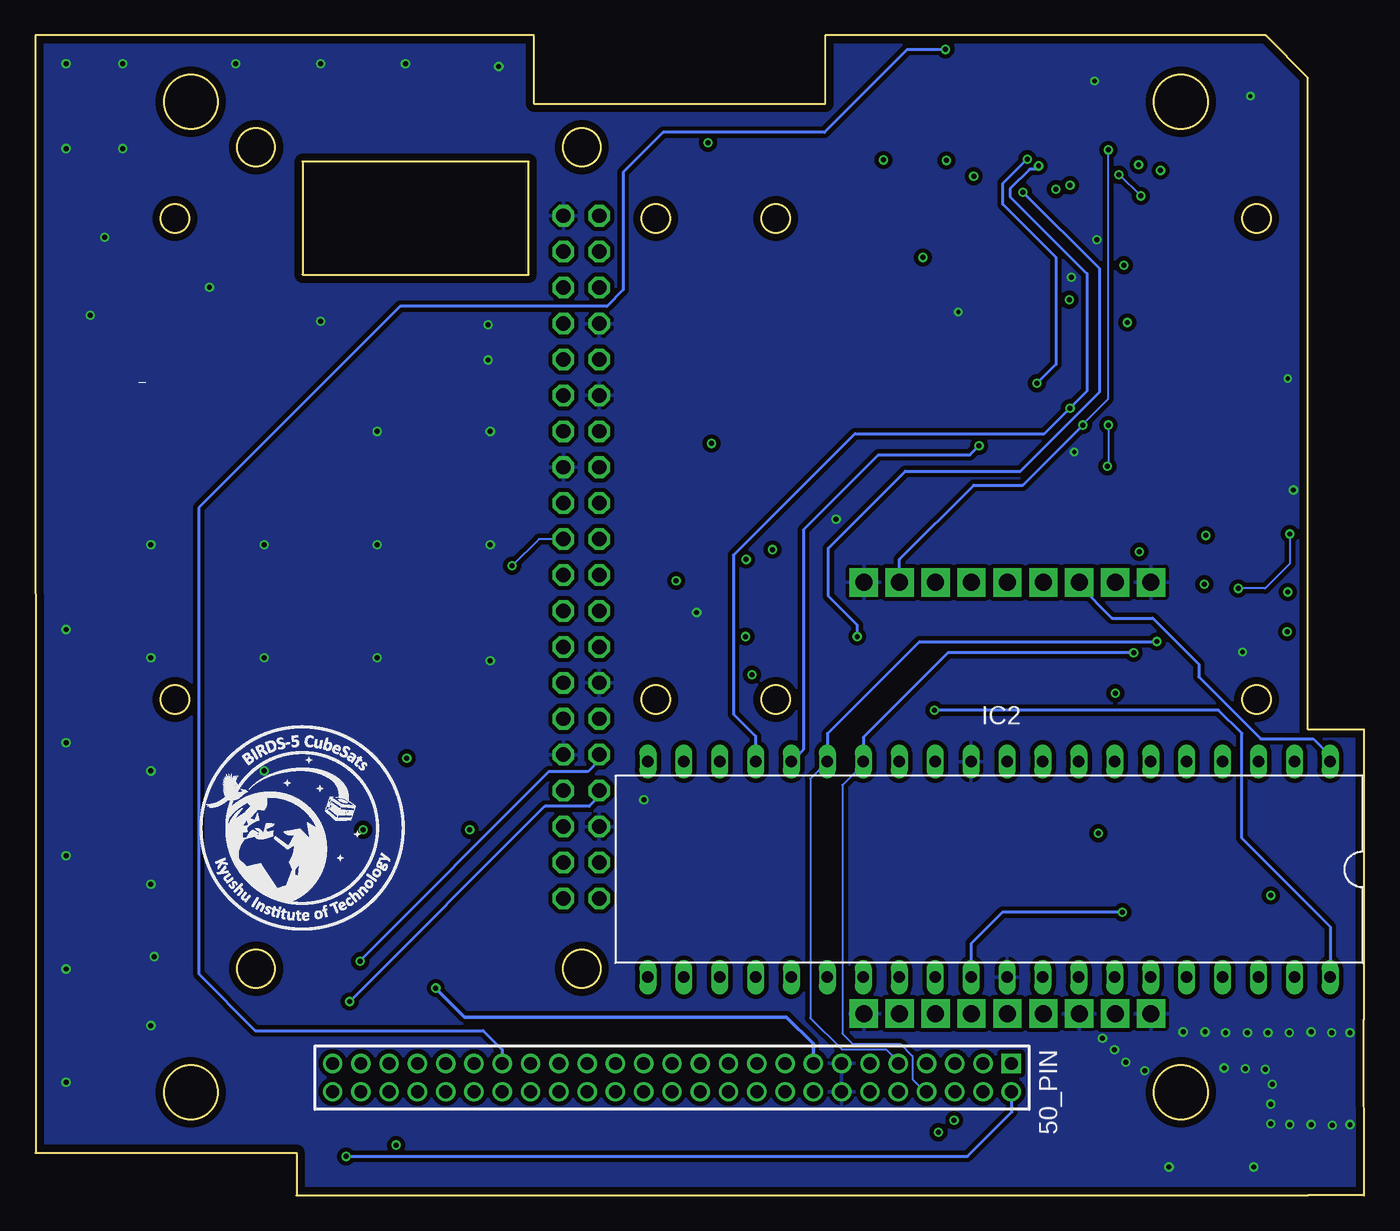
[diagram p7: board, bottom side, seen from below]

Size 93.97 x 82 mm. Coordinates in mm from the lower left corner, seen from the top.
Outline: 58.7,77.18 38.1,77.18 38.1,82 6.97,82 3.97,79 3.97,32.94 0.02,32.94 0.02,12.44 0,0 3.97,0 75.5,0 75.5,3 93.95,3 93.97,82 58.7,82 58.7,77.18
Outline: 59.08,73.08 75.08,73.08 75.08,65.08 59.08,65.08 59.08,73.08
Outline: circle at 55.32,16.02 radius 1.32
Outline: circle at 84.1,69.06 radius 1
Outline: circle at 12.97,7.3 radius 1.9
Outline: circle at 82.97,77.3 radius 1.9
Outline: circle at 41.6,69.06 radius 1
Outline: circle at 78.36,16.02 radius 1.32
Outline: circle at 78.36,74.09 radius 1.32
Outline: circle at 7.6,35.06 radius 1
Outline: circle at 82.97,7.3 radius 1.9
Outline: circle at 41.6,35.06 radius 1
Outline: circle at 84.1,35.06 radius 1
Outline: circle at 50.1,35.06 radius 1
Outline: circle at 50.1,69.06 radius 1
Outline: circle at 12.97,77.3 radius 1.9
Outline: circle at 55.32,74.09 radius 1.32
Outline: circle at 7.6,69.06 radius 1
Copper layers (1+2*15+16): Top 0.018mm / dielectric 0.25mm / Route2 0.035mm / dielectric 1mm / Route15 0.035mm / dielectric 0.25mm / Bottom 0.018mm
Design rules "pban_5mil-l4 *": minimum track width 5mil, minimum drill 0.3mm, track to track 5mil, track to pad 0.229mm, pad to pad 5mil, via to via 5mil, smd to smd 5mil, copper to edge 0.5mm, drill to drill 0.5mm, minimum pad ring 0.15mm, minimum via ring 0.15mm, stop-mask expansion 0.05mm, vias tented up to drill 0.35mm, thermal gap 10mil

### Footprints (pad centres in the part's own frame; a part is rotated, then mirrored left to right if it is on the bottom)
2X25M = drill 0.914 square: 1 -24,-1 | drill 0.914: 2 -24,1; 3 -22,-1; 4 -22,1; 5 -20,-1; 6 -20,1; 7 -18,-1; 8 -18,1; 9 -16,-1; 10 -16,1; 11 -14,-1; 12 -14,1; 13 -12,-1; 14 -12,1; 15 -10,-1; 16 -10,1; 17 -8,-1; 18 -8,1; 19 -6,-1; 20 -6,1; 21 -4,-1; 22 -4,1; 23 -2,-1; 24 -2,1; 25 0,-1; 26 0,1; 27 2,-1; 28 2,1; 29 4,-1; 30 4,1; 31 6,-1; 32 6,1; 33 8,-1; 34 8,1; 35 10,-1; 36 10,1; 37 12,-1; 38 12,1; 39 14,-1; 40 14,1; 41 16,-1; 42 16,1; 43 18,-1; 44 18,1; 45 20,-1; 46 20,1; 47 22,-1; 48 22,1; 49 24,-1; 50 24,1
SML0603 = smd 0.8 x 0.8: A 0.75,0; C -0.75,0
C0603 = smd 1.1 x 1: 1 -0.85,0; 2 0.85,0
C0805 = smd 1.3 x 1.5: 1 -0.95,0; 2 0.95,0
SOIC127P1032X265-16N = smd 1.925 x 0.7: 1 -4.712,4.445; 2 -4.712,3.175; 3 -4.712,1.905; 4 -4.712,0.635; 5 -4.712,-0.635; 6 -4.712,-1.905; 7 -4.712,-3.175; 8 -4.712,-4.445; 9 4.712,-4.445; 10 4.712,-3.175; 11 4.712,-1.905; 12 4.712,-0.635; 13 4.712,0.635; 14 4.712,1.905; 15 4.712,3.175; 16 4.712,4.445
DIL40 = drill 0.813 long: 1 -24.13,-7.62; 2 -21.59,-7.62; 3 -19.05,-7.62; 4 -16.51,-7.62; 5 -13.97,-7.62; 6 -11.43,-7.62; 7 -8.89,-7.62; 8 -6.35,-7.62; 9 -3.81,-7.62; 10 -1.27,-7.62; 11 1.27,-7.62; 12 3.81,-7.62; 13 6.35,-7.62; 14 8.89,-7.62; 15 11.43,-7.62; 16 13.97,-7.62; 17 16.51,-7.62; 18 19.05,-7.62; 19 21.59,-7.62; 20 24.13,-7.62; 21 24.13,7.62; 22 21.59,7.62; 23 19.05,7.62; 24 16.51,7.62; 25 13.97,7.62; 26 11.43,7.62; 27 8.89,7.62; 28 6.35,7.62; 29 3.81,7.62; 30 1.27,7.62; 31 -1.27,7.62; 32 -3.81,7.62; 33 -6.35,7.62; 34 -8.89,7.62; 35 -11.43,7.62; 36 -13.97,7.62; 37 -16.51,7.62; 38 -19.05,7.62; 39 -21.59,7.62; 40 -24.13,7.62
RAB_ACCESS = smd 2.2 x 0.76: P$1 -0.15,-0.635; P$2 3.55,-0.635; P$3 -0.15,-1.905; P$4 3.55,-1.905; P$5 -0.15,-3.175; P$6 3.55,-3.175; P$7 -0.15,-4.445; P$8 3.55,-4.445; P$9 -0.15,-5.715; P$10 3.55,-5.715; P$11 -0.15,-6.985; P$12 3.55,-6.985; P$13 -0.15,-8.255; P$14 3.55,-8.255; P$15 -0.15,-9.525; P$16 3.55,-9.525; P$17 -0.15,-10.795; P$18 3.55,-10.795; P$19 -0.15,-12.065; P$20 3.55,-12.065; P$21 -0.15,-13.335; P$22 3.55,-13.335; P$23 -0.15,-14.605; P$24 3.55,-14.605
2X20 = drill 1.016 octagon: 1 -24.13,-1.27; 2 -24.13,1.27; 3 -21.59,-1.27; 4 -21.59,1.27; 5 -19.05,-1.27; 6 -19.05,1.27; 7 -16.51,-1.27; 8 -16.51,1.27; 9 -13.97,-1.27; 10 -13.97,1.27; 11 -11.43,-1.27; 12 -11.43,1.27; 13 -8.89,-1.27; 14 -8.89,1.27; 15 -6.35,-1.27; 16 -6.35,1.27; 17 -3.81,-1.27; 18 -3.81,1.27; 19 -1.27,-1.27; 20 -1.27,1.27; 21 1.27,-1.27; 22 1.27,1.27; 23 3.81,-1.27; 24 3.81,1.27; 25 6.35,-1.27; 26 6.35,1.27; 27 8.89,-1.27; 28 8.89,1.27; 29 11.43,-1.27; 30 11.43,1.27; 31 13.97,-1.27; 32 13.97,1.27; 33 16.51,-1.27; 34 16.51,1.27; 35 19.05,-1.27; 36 19.05,1.27; 37 21.59,-1.27; 38 21.59,1.27; 39 24.13,-1.27; 40 24.13,1.27
L2012C = smd 1 x 1: 1 -1,0; 2 1,0
QFP50P1200X1200X120-64N = smd 1.475 x 0.3: 1 -5.738,3.75; 2 -5.738,3.25; 3 -5.738,2.75; 4 -5.738,2.25; 5 -5.738,1.75; 6 -5.738,1.25; 7 -5.738,0.75; 8 -5.738,0.25; 9 -5.738,-0.25; 10 -5.738,-0.75; 11 -5.738,-1.25; 12 -5.738,-1.75; 13 -5.738,-2.25; 14 -5.738,-2.75; 15 -5.738,-3.25; 16 -5.738,-3.75; 33 5.738,-3.75; 34 5.738,-3.25; 35 5.738,-2.75; 36 5.738,-2.25; 37 5.738,-1.75; 38 5.738,-1.25; 39 5.738,-0.75; 40 5.738,-0.25; 41 5.738,0.25; 42 5.738,0.75; 43 5.738,1.25; 44 5.738,1.75; 45 5.738,2.25; 46 5.738,2.75; 47 5.738,3.25; 48 5.738,3.75 | smd 0.3 x 1.475: 17 -3.75,-5.738; 18 -3.25,-5.738; 19 -2.75,-5.738; 20 -2.25,-5.738; 21 -1.75,-5.738; 22 -1.25,-5.738; 23 -0.75,-5.738; 24 -0.25,-5.738; 25 0.25,-5.738; 26 0.75,-5.738; 27 1.25,-5.738; 28 1.75,-5.738; 29 2.25,-5.738; 30 2.75,-5.738; 31 3.25,-5.738; 32 3.75,-5.738; 49 3.75,5.738; 50 3.25,5.738; 51 2.75,5.738; 52 2.25,5.738; 53 1.75,5.738; 54 1.25,5.738; 55 0.75,5.738; 56 0.25,5.738; 57 -0.25,5.738; 58 -0.75,5.738; 59 -1.25,5.738; 60 -1.75,5.738; 61 -2.25,5.738; 62 -2.75,5.738; 63 -3.25,5.738; 64 -3.75,5.738
MMCX_908_222101T = smd 1.778 x 1.397: P$1 0,-1.841; P$3 0,1.841 | smd 1.27 x 1.778: P$2 1.905,0; P$4 -1.905,0
SOT65P210X110-6N = smd 1.05 x 0.4: 1 -1.05,0.65; 2 -1.05,0; 3 -1.05,-0.65; 4 1.05,-0.65; 5 1.05,0; 6 1.05,0.65
SO08 = smd 0.6 x 2.2: 1 -1.905,-2.6; 2 -0.635,-2.6; 3 0.635,-2.6; 4 1.905,-2.6; 5 1.905,2.6; 6 0.635,2.6; 7 -0.635,2.6; 8 -1.905,2.6
SOT346-R = smd 0.7 x 0.9: 1 0.95,-1.05; 2 -0.95,-1.05; 3 0,1.05
R0603 = smd 1 x 1.1: 1 -0.85,0; 2 0.85,0
R0805 = smd 1.3 x 1.5: 1 -0.95,0; 2 0.95,0
TRIM_PVG3A200C01R00 = smd 1.1 x 0.9: 1 1.15,-1.65; 3 -1.15,-1.65 | smd 1.4 x 0.9: 2 0,1.65
CHIPLED_0603 = smd 0.8 x 0.8: A 0,-0.75; C 0,0.75
BIM1H = drill 1.2 pad 2 square: P$1 1.27,21.59; P$2 1.27,19.05; P$3 1.27,16.51; P$4 1.27,13.97; P$5 1.27,11.43; P$6 1.27,8.89; P$7 1.27,6.35; P$8 1.27,3.81; P$9 1.27,1.27; P$10 31.75,1.27; P$11 31.75,3.81; P$12 31.75,6.35; P$13 31.75,8.89; P$14 31.75,11.43; P$15 31.75,13.97; P$16 31.75,16.51; P$17 31.75,19.05; P$18 31.75,21.59
SOT353-1 = smd 0.6 x 0.6: 1 -0.75,-0.9; 3 0.75,-0.9; 4 0.75,0.9; 5 -0.75,0.9 | smd 0.4 x 0.6: 2 0,-0.9
BIRDS5_LTC4361 = smd 0.25 x 0.7: 1 -0.675,-0.925; 2 -0.225,-0.925; 3 0.225,-0.925; 4 0.675,-0.925; 5 0.675,0.925; 6 0.225,0.925; 7 -0.225,0.925; 8 -0.675,0.925 | smd 1.37 x 0.54: 9 0,0
SM49 = smd 5.08 x 1.778: 1 -4.826,0; 2 4.826,0

### Placement (x,y rotation side)
50_PIN  48.95,8.32 180 bottom
APD1  2.28,23.52 90 top
APD2  4.68,23.37 90 top
APD3  7.28,23.22 90 top
APD4  9.78,23.17 90 top
C2  23.53,52.73 180 top
C3  12.45,19.09 270 top
C4  9.22,18.99 270 top
C5  12.53,27.35 270 top
C6  31.14,70.68 0 top
C7  30.07,54.07 0 top
C8  48.95,25.17 0 top
C9  40.52,25.02 0 top
C10  61.6,29.01 90 top
C18  8.16,62.28 180 top
C21  6.17,54.07 270 top
C22  8.7,54.18 270 top
C23  11.11,54.21 270 top
C24  6.2,50.73 270 top
C25  8.65,50.63 270 top
C26  38.21,68.01 0 top
C27  12.15,50.24 90 top
C35  41.95,42.76 270 top
C36  11.77,38.03 180 top
C37  11.63,40.76 180 top
C38  38.92,40.85 180 top
C39  39,43.6 180 top
C40  38.52,33.23 0 top
C41  29.15,48.35 270 top
C42  48.15,55.35 270 top
C43  15.8,51.9 0 top
C44  19.4,46.8 0 top
C45  34.4,48.4 270 top
FM_SF  39.47,61.15 0 top
IC2  26.53,23.04 180 bottom
JP1  22.36,75.06 90 top
JP5  55.36,45.12 90 top
L5  12.49,23.13 270 top
MCU_SF  17.31,63.4 0 top
MMCX_908_222101T  3.17,8.2 180 top
MOS1  7.77,47.37 180 top
MOS2  50.35,43.22 90 top
MOS3  66.25,33.3 180 top
OPAMP  46.25,49.25 90 top
Q1  7.38,41.1 0 top
Q2  46.24,38.38 0 top
Q3  50.8,39.15 0 top
Q4  69.71,22.95 0 top
R1  8.37,59.8 0 top
R2  8.37,57.4 0 top
R3  48.2,58.91 180 top
R4  32.07,63.39 270 top
R5  34.66,54.34 0 top
R7  8.21,66.53 0 top
R8  48.16,63.31 180 top
R9  32.13,59.49 270 top
R10  11.54,44.85 180 top
R11  48.17,65.91 180 top
R12  34.82,67.96 180 top
R13  8.19,64.41 0 top
R14  6.31,37.96 180 top
R15  66.05,28.29 90 top
R16  66.07,24.89 180 top
R17  4.95,19.41 270 top
R18  46.3,44.89 0 top
R19  2.43,19.33 90 top
R20  41.76,38.83 90 top
R21  2.49,26.89 270 top
R22  4.71,26.89 270 top
R23  7.31,26.87 270 top
R24  9.91,27.25 270 top
R25  43.75,53.1 180 top
R26  38.42,35.95 90 top
R27  15.7,47.1 0 top
R28  15.75,49.25 0 top
R29  19.35,49.2 0 top
R30  40.05,51.55 0 top
R31  38.87,38.65 0 top
R32  24.6,47.9 270 top
R33  31.75,48.35 90 top
R34  51,55.5 90 top
R35  51.45,47.95 90 top
R36  39.1,49.4 180 top
R37  51.45,51.25 90 top
R38  10.42,34.02 90 top
R39  12.44,34.02 90 top
SFD2  5.65,65.4 180 top
TRX1  36.66,11.58 90 top
U2  23.24,55.12 90 top
U$1  45.2,41.8 0 top
U$2  71.2,28.2 90 top
U$3  7.4,44.4 270 top
XTAL1  27.35,62.66 270 top
XTAL2  44.51,21.11 180 top

### Tracks (layer width: path | path; a pad name or v marks a point on that pad's centre or on a via)
APRS_AFIN  (via drill 0.35)
  Top 0.152: JP1.P$11 29.34,74.1 27.94,72.7 25.93,72.7 24.15,70.92 v24.13,70.92
  Top 0.2: R26.2 38.02,37.2 R31.1 | C38.1 39.77,40.22 39.25,39.7 38.4,39.7 38.02,39.32 R31.1 | R31.1 36.7,38.65 v35.85,39.5 | v30.4,34.3 33.67,34.3 R31.1
  Bottom 0.2: v35.85,39.5 35.85,40.3 37.9,42.35 37.9,45.75 32.45,51.2 24.3,51.2 18.7,56.8 18.7,65.49 v24.13,70.92 | v30.4,34.3 10.3,34.3 8.64,32.65 8.64,25.25 2.4,19 IC2.40
APRS_AFOUT  (via drill 0.35)
  Top 0.152: v29.54,73.16 29.79,73.16 30.61,73.99 JP1.P$13
  Top 0.2: R27.1 14.85,46.35 v15.9,45.5
  Route15 0.2: v29.54,73.16 26.28,73.18 25.05,71.95 25.05,65.2 13.9,54.05 13.9,46.7 15.11,45.49 15.3,45.5 v15.9,45.5 40.2,45.45 46.85,38.8 46.85,31.93 IC2.19
APRS_XTAL1
  Top 0.2: XTAL2.1 48,22.45 C8.1 45.97,27.2 34.8,27.2 32.88,29.12 IC2.13
APRS_XTAL2
  Top 0.2: XTAL2.2 39.57,21.22 C9.1 34.28,25.02 30.34,28.96 IC2.12
APRSDP_5V0  (via drill 0.35)
  Top 0.152: v43.75,39.5 44.3,40.05 45.1,40.05 45.42,40.38 U$1.3
  Top 0.2: R38.2 R39.2 16.97,34.87 v17.6,35.5 | TRX1.P$17 15.2,40.92 12.64,40.92 C37.1 12.62,40.62 C36.1 | C5.2 12.53,24.17 L5.1 17.33,24.13 v18.8,25.6 | OPAMP.8 44.95,47.34 45.65,48.05 45.65,52 44.6,53.05 R25.1 44.65,53.15 v46.15,53.15 | MOS2.1 48.65,43.22 v48.65,43.45 | v41.85,45.65 41.85,43.81 C35.1 39.96,43.71 C39.1 | R17.1 5.89,21.2 v6.6,21.2
  Route2 0.2: v48.65,43.45 48.65,50.65 v46.15,53.15 43.35,53.15 41.85,51.65 v41.85,45.65 41.85,41.4 v43.75,39.5 42.45,39.5 37.15,44.8 19.08,44.8 TRX1.P$17 v17.61,35.51 v17.6,35.5 | v17.6,35.5 17.6,35.45 18.8,34.25 v18.8,25.6 | v17.6,35.5 19.9,33.2 24.1,33.2 25.26,32.04 IC2.10
  Route15 0.2: v6.6,21.2 15.3,21.2 18.8,24.7 v18.8,25.6
APSF_MCU_RXB  (via drill 0.35)
  Top 0.152: v23.15,57.4 23.15,55.75 23.78,55.12 24.25,55.12
  Top 0.2: 24.25,55.12 U2.2 25.09,55.12 v27.23,52.98 | v23.82,73.25 23.82,74.47 JP1.P$3
  Bottom 0.2: v23.15,57.4 21.8,58.75 21.8,66.3 25.55,70.05 25.55,71.53 23.85,73.25 v23.82,73.25 | IC2.16 39.66,31.5 39.66,47.04 34.36,52.34 27.87,52.34 v27.23,52.98
APSF_MCU_RXB-2
  Top 0.2: MCU_SF.32 21.06,56.7 21.89,55.87 U2.4
APSF_MCU_TXB  (via drill 0.35)
  Top 0.152: MCU_SF.31 20.55,55.9 v20.8,55.65
  Top 0.2: JP1.P$1 22.99,72.8 v23.02,72.77
  Bottom 0.2: v23.02,72.77 23.24,72.55 23.65,72.55 25.05,71.15 25.05,70.6 19.6,65.15 19.6,56.85 v20.8,55.65 22.6,53.85 36,53.85 44.6,45.25 44.6,34.02 43.04,32.46 IC2.17
AREF
  Top 0.2: R26.1 37.5,34.18 37.5,33.4 C40.1 27.55,33.23 26.54,32.22 26.54,27.46 22.72,23.64 IC2.32
AVCC  (via drill 0.35)
  Top 0.2: L5.2 12.49,19.98 C3.1 | C3.1 12.35,19.84 C4.1 | C3.1 17.04,19.94 v17.1,20
  Bottom 0.2: v17.1,20 25.6,20 27.8,17.8 IC2.30
DEBUG  (via drill 0.35)
  Top 0.152: v17.35,72.15 19.23,74.04 19.23,75.66 20.38,76.8 28.65,76.8 29.34,77.49 JP1.P$12 | MCU_SF.60 15.56,70.41 v15.8,70.65
  Bottom 0.152: v15.8,70.65 17.3,72.15 v17.35,72.15
DIO_MAIN_PIC
  Top 0.2: JP5.12 55.24,32.54 57.14,32.54 58.28,31.39 58.28,17.37 64.95,10.71 50_PIN.41
FM_RESET
  Top 0.2: FM_SF.3 32.59,63.05 R4.2
FM_W#
  Top 0.2: FM_SF.9 45.55,56.7 47.35,58.5 R3.2
GATE1
  Top 0.152: MOS3.2 68.65,33.3 69.25,32.7 69.25,28.9 69.72,28.43 U$2.6
GATE3  (via drill 0.35)
  Top 0.152: MOS1.2 9.47,47.37 9.95,47.85 9.95,48.45 9.6,48.8 5.85,48.8 5.25,48.2 v5.25,46.75 | v8.9,42.9 9.2,43.2 9.2,43.85 8.88,44.17 U$3.6
  Bottom 0.152: v5.25,46.75 5.25,44.65 7,42.9 v8.9,42.9
GATE4
  Top 0.152: MOS2.2 50.35,41.25 49.9,40.8 49.15,40.8 46.57,43.38 45.62,43.38 45.45,43.2 45.45,42.74 U$1.6
GND  (via drill 0.3, 0.35)
  Top 0.152: MCU_SF.25 17.56,58.54 17.35,58.75 15.35,58.75 15.3,58.7 15.28,58.7 15.06,58.48 MCU_SF.20 15.06,55.9 12.52,53.36 C23.2 | U$3.1 6.93,45.08 7.13,44.88 7.13,44.67 U$3.9 7.4,43.54 7.52,43.42 7.66,43.42 8.16,42.92 8.16,42.6 8.36,42.4 8.36,41.46 8.33,41.43 Q1.1 | v20.7,64.9 21.95,63.65 MCU_SF.41 | v18.9,67.55 18.36,68.09 17.78,68.09 17.56,68.32 MCU_SF.56 | C18.2 7.3,63.16 7.38,63.24 10.38,63.24 10.43,63.2 11.53,63.2 MCU_SF.9
  Top 0.305: 50_PIN.13 50_PIN.14
  other vias: 8.05,77.7 28.7,62.45 19.07,78.77 8.6,38.4 20.5,52.55 5.4,57.75 47.2,41.2 85.56,16.88 85.8,46 81.66,64.2 67.8,80 87.8,74 69.8,46 61.8,54 91.8,32 50.94,27.96 37.34,47.8 5,49.86 61.2,79.8 73.8,80 79.8,80 87.8,80 91.8,80 91.8,74 89.06,67.72 73.8,61.8 61.95,61.55 90.1,62.22 69.8,54 61.8,46 61.8,37.8 69.8,38 77.8,46 77.8,38 91.8,40 85.8,38 77.8,30 77.8,22 85.8,22 85.8,30 91.8,24 91.8,16 85.8,12 91.8,8 13.8,2 7.8,2 9.9,9 8.4,8.95 7,8.9 6.5,7.85 6.6,6.45 6.6,5.05 5.25,5 3.75,5 2.25,4.95 1,5 1,11.5 2.3,11.5 3.75,11.55 5.3,11.5 6.8,11.5 8.25,11.5 9.8,11.5 11.25,11.55 12.8,11.55 15.5,8.8 16.85,9.4 17.65,10.3 18.5,11.1 61.95,59.05
  pour Top (isolate 0.305): -1.26,82.3 94,82.3 94,-0.2 -1.26,-0.2
  pour Bottom (isolate 0.305): -1.6,82.55 94.45,82.55 94.5,82.6 94.5,-0.5 -1.6,-0.5 -1.65,-0.55 -1.65,82.5
  pour Route15 (isolate 0.305): -1.9,83.5 95.15,83.5 95.15,-0.75 -1.85,-0.75 -1.85,83.45
HOLD
  Top 0.2: R12.2 33.97,66.38 FM_SF.1
LED
  Top 0.2: MCU_SF.3 9.44,66.15 R7.2
LED2_GRN
  Top 0.2: IC2.2 4.94,27.97 R22.1
LED3_YLW
  Top 0.2: IC2.3 7.48,27.89 R23.1
LED4_BLU
  Top 0.2: IC2.4 10.02,28.21 R24.1
MB_DIO_APRSDP_5V0
  Top 0.2: Q3.2 49.85,37.9 52.4,35.35 52.4,14.7 54.9,12.2 61.55,12.2 62.95,10.8 50_PIN.39
MB_DIO_SFWARD_3V3  (via drill 0.35)
  Top 0.2: Q2.2 45.27,37.35 43.85,37.35 v43.3,36.8 | Q1.2 6.23,39.85 v5.45,39.85 | v68.45,3.55 64.65,3.55 62.95,5.25 50_PIN.40
  Route15 0.2: v43.3,36.8 7.75,36.8 5.45,39.1 v5.45,39.85 5.45,41.2 6.15,41.9 6.15,64.3 11.3,69.45 11.3,71.2 15.63,75.53 49.27,75.53 52.8,72 52.8,63.6 53.5,62.9 68.3,62.9 81.85,49.35 81.85,10.4 75,3.55 v68.45,3.55
MB_SF_RX  (via drill 0.35)
  Top 0.2: MCU_SF.1 11.55,67.13 12.13,67.13 12.6,67.6 12.6,72.2 16.71,76.31 16.71,79.11 18.8,81.2 29.42,81.2 v29.62,81.01 30.61,80.01 JP1.P$14
  Bottom 0.2: 50_PIN.37 60.95,10.3 62.3,11.65 78.41,11.65 82.41,15.65 82.41,48.59 68.16,62.85 53.55,62.85 52.4,64 52.4,72.31 49.57,75.14 38.16,75.14 32.3,81.01 v29.62,81.01 | v29.62,81.01
MB_SF_TX
  Top 0.152: 21.16,76.38 30.82,76.38 31.88,77.44 JP1.P$16
  Top 0.2: MCU_SF.2 12.45,66.65 12.95,67.15 12.95,70.15 14.15,71.35 17.71,71.35 20.07,73.7 20.07,75.28 21.16,76.38 | 50_PIN.38 60.95,5.55 64.55,1.95 73.4,1.95 81.8,10.35 81.8,47.5 81.8,47.85 81.8,48.25 67.2,62.85 53.35,62.85 52.45,63.75 52.45,72.4 49.04,75.81 38.52,75.81 37.55,76.78 32.56,76.78 31.88,77.46 JP1.P$16
MCAM_SPI_CS
  Top 0.152: JP5.24 54.12,48.93 55.45,47.6 58.1,47.6 59.23,46.47 59.23,18.17 66.95,10.45 50_PIN.43
MCAM_SPI_MISO  (via drill 0.35)
  Top 0.152: 50_PIN.45 68.95,10.2 60.25,18.9 v60.25,44.5
  Bottom 0.152: JP5.21 58.36,46.39 v60.25,44.5
MCAM_SPI_MOSI
  Top 0.152: JP5.19 57.98,43.85 58.8,43.03 58.8,17.6 65.95,10.45 65.95,8.3 66.93,7.32 50_PIN.44
MCAM_SPI_SCLK
  Top 0.152: JP5.23 57.73,48.93 59.6,47.06 59.6,18.55 67.95,10.2 67.95,8.2 68.83,7.32 50_PIN.46
MCLR  (via drill 0.35)
  Top 0.152: MCU_SF.7 16.65,64.15 20.35,67.85 21.97,67.85 26.15,72.03 v27.61,72.03 | v34,73.19 34.43,73.63 34.43,75.4 JP1.P$19 | v29,5.3 28.8,5.3 27.95,6.15 27.95,8.32 50_PIN.3
  Top 0.2: MCU_SF.7 10.3,64.15 10.04,64.41 R13.2
  Route15 0.152: v29,5.3 29,5.25 73.8,5.25 80.75,12.2 80.75,48 70.95,57.8 53.35,57.8 51.85,59.3 51.85,71.35 50.01,73.19 37.7,73.19 v34,73.19 v33.99,73.19 32.83,72.03 v27.61,72.03
MP_DIO_MULTSPEC_5V
  Top 0.2: Q4.2 68.76,20.54 76.55,12.75 76.55,7.05 73.95,4.45 65.95,4.45 64.95,5.45 50_PIN.42
MULTISPEC_5V  (via drill 0.35)
  Top 0.152: v70.8,25.85 71.9,25.85 73.1,27.05 73.1,28.15 72.83,28.43 U$2.3 | v67.7,30.9 67.7,32.25 MOS3.1
  Top 0.2: JP5.2 JP5.4 | v63.25,25.85 62.45,25.85 61.6,26.7 C10.1
  Route2 0.152: v70.8,25.85 67.7,28.95 v67.7,30.9
  Route2 0.2: v70.8,25.85 v63.25,25.85 61.3,23.9 61.3,20.39 59.76,18.85 55.35,18.85 54.09,20.11 JP5.2
N$2
  Top 0.2: C18.1 9.57,62.28 9.94,62.65 MCU_SF.10
N$7
  Top 0.2: MCU_SF.14 10.07,60.65 R1.2
N$8
  Top 0.2: MCU_SF.15 10.6,60.15 10.25,59.8 10.25,58.43 R2.2
N$10
  Top 0.2: R32.3 20.35,49.05 R29.2
N$11
  Top 0.2: R7.1 6.03,66.53 SFD2.A
N$12
  Top 0.2: R21.2 2.49,24.48 APD1.A
N$13
  Top 0.2: APD2.A 4.68,26.01 R22.2
N$14
  Top 0.2: R23.2 7.28,25.99 APD3.A
N$15
  Top 0.2: R24.2 9.78,26.27 APD4.A
N$16
  Top 0.2: R27.2 16.55,47.4 14.9,49.05 R28.1 14.9,51.85 C43.1
N$17
  Top 0.2: C44.1 18.5,46.85 R29.1 16.65,49.2 R28.2
N$18
  Top 0.2: C42.1 47.25,56.2 46.2,55.15 40.65,55.15 34.75,49.25 C45.1 34.35,49.2 R33.2
N$19
  Top 0.2: R33.1 C41.2
N$20
  Top 0.2: OPAMP.2 49.03,48.8 R35.2 R37.1
N$21
  Top 0.2: OPAMP.5 41.29,51.16 R30.2 40.9,51.75 42.25,53.1 R25.2
N$22
  Top 0.2: C41.1 27.9,49.2 26.6,47.9 R32.2
N$34
  Top 0.2: IC2.38 7.48,20.08 8.6,21.2 8.6,31.35 R38.1
N$38
  Top 0.2: R39.1 17.86,33.17 19,32.03 19,27.1 20.18,25.92 IC2.33
ON1
  Top 0.152: Q4.3 71.65,24 73.75,26.1 73.75,28.2 73.08,28.88 U$2.4
  Top 0.2: R16.1 67.81,24 Q4.3
ON3
  Top 0.152: U$3.4 7.38,42.82 7.38,42.05
  Top 0.2: Q1.3 7.38,42.05 7.38,38.18 R14.1
ON4
  Top 0.152: R20.1 42.63,38.85 45.34,38.85 45.92,39.43 Q2.3 | U$1.4 46.24,40.51 Q2.3 | Q2.3 50.03,39.43 Q3.3
OPAMP_A+
  Top 0.2: R34.1 48.3,54.65 | 48.3,54.65 C42.2 | OPAMP.3 47.46,49.88 47.1,50.25 47.1,52.45 48.3,53.65 48.3,54.65
OSC1
  Top 0.152: XTAL1.1 27.35,64.75 25.75,63.15 MCU_SF.40
  Top 0.254: C6.1 28.34,70.68 27.35,69.69 XTAL1.1
OSC2
  Top 0.152: MCU_SF.39 25.65,62.65 27.35,60.95 27.35,57.7
  Top 0.254: XTAL1.2 27.35,57.7 27.35,55.18 28.46,54.07 C7.1
PA1
  Top 0.2: R19.1 4.87,18.48 R17.2 IC2.39
PD0_RXA  (via drill 0.35)
  Top 0.152: v21.8,71.13 23.03,71.13 25.35,73.45 26.3,73.45 26.8,73.96 JP1.P$7
  Route15 0.2: v16.3,38.35 16.3,38.5 13.45,41.35 13.45,60.55 19.8,66.9 19.8,69.13 v21.8,71.13
  Bottom 0.152: IC2.14 35.42,30.48 36.9,29 36.9,11.43 36.17,10.7 32.8,10.7 31.94,9.84 31.94,8.21 31.05,7.32 50_PIN.8
  Bottom 0.2: v16.3,38.35 29.45,38.35 35.42,32.38 IC2.14
PD1_TXA  (via drill 0.35)
  Top 0.152: v20.8,71.4 21.2,71.8 23.26,71.8 25.53,74.07 JP1.P$5
  Route15 0.2: v20.8,71.4 20.65,71.25 20.65,71.2 12.8,63.35 12.8,40.95 14.6,39.15 v14.65,39.15
  Bottom 0.152: IC2.15 39.17,29.45 39.17,12.53 36.95,10.31 33.81,10.31 32.95,9.45 50_PIN.9
  Bottom 0.2: v14.65,39.15 31.45,39.15 37.96,32.64 IC2.15
PGC  (via drill 0.35)
  Top 0.152: MCU_SF.42 24,64.15 24.7,64.85 24.7,69.21 26.54,71.05 28.15,71.05 29.2,72.1 32.17,72.1 33.12,73.05 33.12,75.41 | v30.1,4.45 25.55,4.45 23.87,6.13 23.87,8.56 24.62,9.32 50_PIN.1
  Top 0.2: v46.4,74.4 44.5,72.5 33.68,72.5 33.12,73.06 33.12,75.41 JP1.P$17
  Route15 0.2: v46.4,74.4 49.7,74.4 52.3,71.8 52.3,61.55 53.5,60.35 69.3,60.35 81.35,48.3 81.35,11.9 73.9,4.45 v30.1,4.45
PGD  (via drill 0.35)
  Top 0.152: 38.53,75.3 37.45,76.38 32.32,76.38 31.88,75.94 JP1.P$15 31.88,73.9 30.48,72.5 29.1,72.5 27.97,71.37 25.9,71.37 22.08,67.55 20.55,67.55 19.5,66.5 19.5,62.65 20.5,61.65 MCU_SF.37
  Top 0.2: 38.53,75.3 48.9,75.3 51.95,72.25 51.95,61.8 53.4,60.35 69,60.35 81.35,48 81.35,46.9 81.35,46.15 81.35,10.75 73.35,2.75 v72,2.75
  Bottom 0.2: v72,2.75 28.05,2.75 24.9,5.9 24.9,7.27 50_PIN.2
RSSI  (via drill 0.35)
  Top 0.152: v18.1,73.9 18.1,75.28 19.94,77.12 25.1,77.12 25.53,77.56 JP1.P$6
  Top 0.2: v19.9,54.45 19.9,54.5 18.56,55.84 MCU_SF.27
  Bottom 0.152: v19.9,54.45 19.9,54.5 18.1,56.3 v18.1,73.9
  Bottom 0.2: TRX1.P$11 32.85,44.95 27.6,50.2 24.15,50.2 v19.9,54.45
SENSE1
  Top 0.152: MOS3.6 66.05,31.8 R15.2 67.96,29.24 69.22,27.98 U$2.7
SENSE3
  Top 0.152: MOS1.6 6.72,46.28 7.05,45.95 9.49,45.95 R10.2 10.37,44.62 U$3.7
SENSE4
  Top 0.152: MOS2.6 49.7,44.5 49.1,45.1 47.46,45.1 R18.2 47.25,44.7 46.25,43.7 45.45,43.7 44.97,43.23 U$1.7
SFWARD_3V3_2  (via drill 0.35)
  Top 0.152: C2.2 22.34,53.07 U2.5 21.52,54.37 20.8,53.65 19.8,53.65 18.06,55.39 MCU_SF.26 18.06,58.48 17.44,59.1 14.18,59.1 13.78,58.7 | 13.78,58.7 13.61,58.53 13.61,57.71 MCU_SF.17 13.56,58.51 v16.75,61.7 | 13.78,58.7 14.34,58.7 14.52,58.53 14.52,57.71 MCU_SF.19 | MCU_SF.38 22.05,62.15 20.9,63.3 v20.85,63.3 | v5.4,42.65 5.1,42.95 5.1,43.7 5.57,44.17 U$3.3 | v11.2,46.65 8.89,46.65 MOS1.1 | JP1.P$9 28.07,73.75 27.46,73.14 25.44,73.14 22.8,70.5 17.5,70.5 17.06,70.06 MCU_SF.57 17.06,65.81 v17,65.75 | R12.1 37.31,67.96 C26.1 37.36,67.8 38.36,66.8
  Top 0.2: R3.1 49.05,63.27 R8.1 R11.1 49.02,66.48 48.7,66.8 38.36,66.8 | 32,64.24 R4.1 34.67,64.24 FM_SF.2 35.82,64.33 36.35,64.85 36.35,67.28 R12.1 | 32,64.24 31.54,64.24 30.9,63.6 30.9,61.57 R9.1 31.64,60.34 30.9,59.6 30.9,57.05 33.61,54.34 R5.1 | MCU_SF.17 13.56,55.96 12.66,55.06 C23.1 11.08,55.03 C22.1 8.59,54.92 C21.1 | C21.1 5.77,54.92 5.1,54.25 5.1,52.25 5.77,51.58 C24.1 8.55,51.58 C25.1 9.47,51.48 10.7,50.25 10.7,47.35 10.07,46.72 MOS1.1 | R13.1 6.85,64.41 6.17,63.73 C21.1 | v31.2,66.3 32,65.5 32,64.24 | C27.1 12.15,47.6 v11.2,46.65
  Route2 0.2: v16.75,61.7 18.35,63.3 | 18.35,63.3 v20.85,63.3 23.85,66.3 v31.2,66.3 | 18.35,63.3 18.35,63.35 17,64.7 v17,65.75 | v11.2,46.65 7.2,42.65 v5.4,42.65
  pour Route2 (isolate 0.305): -1.2,0 94.8,0 94.8,83 -1.2,83
SPI_FM_CS
  Top 0.152: FM_SF.7 36.07,57.98 36.95,57.1 36.95,53.65 34.4,51.1 20,51.1 16.06,55.04 MCU_SF.22
  Top 0.2: FM_SF.7 32.82,57.98 32.16,58.64 R9.2
SPI_MISO
  Top 0.152: MCU_SF.23 16.56,55.04 20.1,51.5 34,51.5 35.51,53.01 R5.2 35.51,55.95 FM_SF.8
SPI_MOSI  (via drill 0.35)
  Top 0.152: FM_SF.15 42.32,64.33 40.35,62.35 40.35,55.65 35.1,50.4 19.25,50.4 18.15,51.5 v18.15,51.55 | v18.1,54.45 17.06,55.49 MCU_SF.24
  Top 0.2: FM_SF.15 45.07,64.33 46.09,63.31 R8.2
  Bottom 0.152: v18.1,54.45 18.1,51.6 v18.15,51.55
SPI_SCK
  Top 0.152: FM_SF.16 42.59,65.59 39.6,62.6 39.6,55.55 34.8,50.75 19.9,50.75 15.56,55.09 MCU_SF.21
  Top 0.2: FM_SF.16 47,65.59 R11.2
SUP_3V3_2  (via drill 0.35)
  Top 0.152: R14.2 4.65,38.77 4.65,44.8 5.45,45.6 7.8,45.6 U$3.8
  Top 0.2: R10.1 12.49,44.39 v11.3,43.2 9.55,41.45 9.55,37.85 8.7,37 5.9,37 5.46,37.44 R14.2
  Top 0.254: 50_PIN.26 50_PIN.25
  Route2 0.2: 50_PIN.25 48.95,10.7 47.3,12.35 40.5,12.35 39.15,13.7 39.15,17.66 35.16,21.65 18.75,21.65 11.3,29.1 v11.3,43.2
SUP_5V0  (via drill 0.35)
  Top 0.152: R18.1 44.47,44.02 44.47,42.77 | R20.2 42.68,39.68 43.4,40.4 43.4,41.77 44.2,42.58 44.47,42.58 44.47,42.77 | 44.47,42.77 U$1.8 | R15.1 66.23,27.52 U$2.8
  Top 0.2: R15.1 65.22,26.51 R16.2
  Top 0.254: 50_PIN.16 50_PIN.15 | R16.2 65.65,24.46 v65.65,14.65 | v43.7,44.95 45.29,44.95 R18.1
  Route2 0.254: v65.65,14.65 65.65,16.55 63.9,18.3 54.45,18.3 52.05,20.7 52.05,38.6 45.7,44.95 v43.7,44.95
  Bottom 0.254: 50_PIN.15 38.95,10.7 40.85,12.6 63.6,12.6 v65.65,14.65
TRX1
  Top 0.305: TRX1.P$2 17.61,12.21 15.67,10.27 3.4,10.27 MMCX_908_222101T.P$1
TRX1_AFOUT  (via drill 0.35)
  Top 0.152: v14.4,72.45 17.25,75.3 17.25,79.1 19,80.85 27.56,80.85 28.07,80.34 JP1.P$10
  Top 0.2: C38.2 28.65,40.85 27.77,41.73 TRX1.P$13
  Route15 0.152: TRX1.P$13 27.77,39.82 25.2,37.25 14.75,37.25 12.05,39.95 12.05,70.1 v14.4,72.45
TRX1_RXSELECT
  Top 0.2: OPAMP.6 41.43,49.88 40.85,49.3 40.05,49.3 R36.1 39.95,48.3 37.9,46.25 30.3,46.25 29.6,45.55 22.2,45.55 20.15,43.5 TRX1.P$16 | IC2.1 2.49,30.57 R21.1
  Bottom 0.2: TRX1.P$16 20.15,43.13 17.83,40.81 14.96,40.81 11.7,37.55 11.7,36.65 7.32,32.27 6.97,32.27 6.95,32.27 3.6,32.27 2.4,31.07 IC2.1
TRX1_TXD  (via drill 0.35)
  Top 0.152: v15.95,72.85 17.6,74.5 17.6,78.85 19.32,80.57 26.38,80.57 26.8,80.15 JP1.P$8
  Top 0.2: R35.1 51.2,47.34 OPAMP.1 48,46.5 39.6,46.5 38.45,45.35 30.55,45.35 29.95,44.75 26.45,44.75 25.23,43.53 TRX1.P$14
  Route15 0.152: TRX1.P$14 25.23,39.88 23,37.65 14.85,37.65 12.4,40.1 12.4,69.3 v15.95,72.85
TRX1_TXSELECT
  Top 0.2: OPAMP.7 41.16,48.62 38.4,45.85 30.45,45.85 29.75,45.15 24.1,45.15 22.7,43.75 TRX1.P$15
UART_RX  (via drill 0.35)
  Top 0.2: 50_PIN.48 70.95,6.3 71.95,5.3 73.85,5.3 75.6,7.05 75.6,9.85 v71.75,13.7
  Bottom 0.2: JP5.8 54.09,28.21 54.8,27.5 57.95,27.5 v71.75,13.7
UART_TX  (via drill 0.35)
  Top 0.2: v71,16.55 71,9.37 50_PIN.47
  Bottom 0.2: JP5.10 54.09,30.76 54.9,29.95 57.67,29.95 57.7,29.92 71,16.57 v71,16.55

### Text on the board
tNames: BIRDS-5 FM MB2: SF-Ward, APRS-DP, Multi-Spec Camera | Designed By: Edgar, Ramson, Bonny - Oct.2021